# EAGLE design MicroMod_ATP_CarrierBoard (EAGLE 9.5.2)
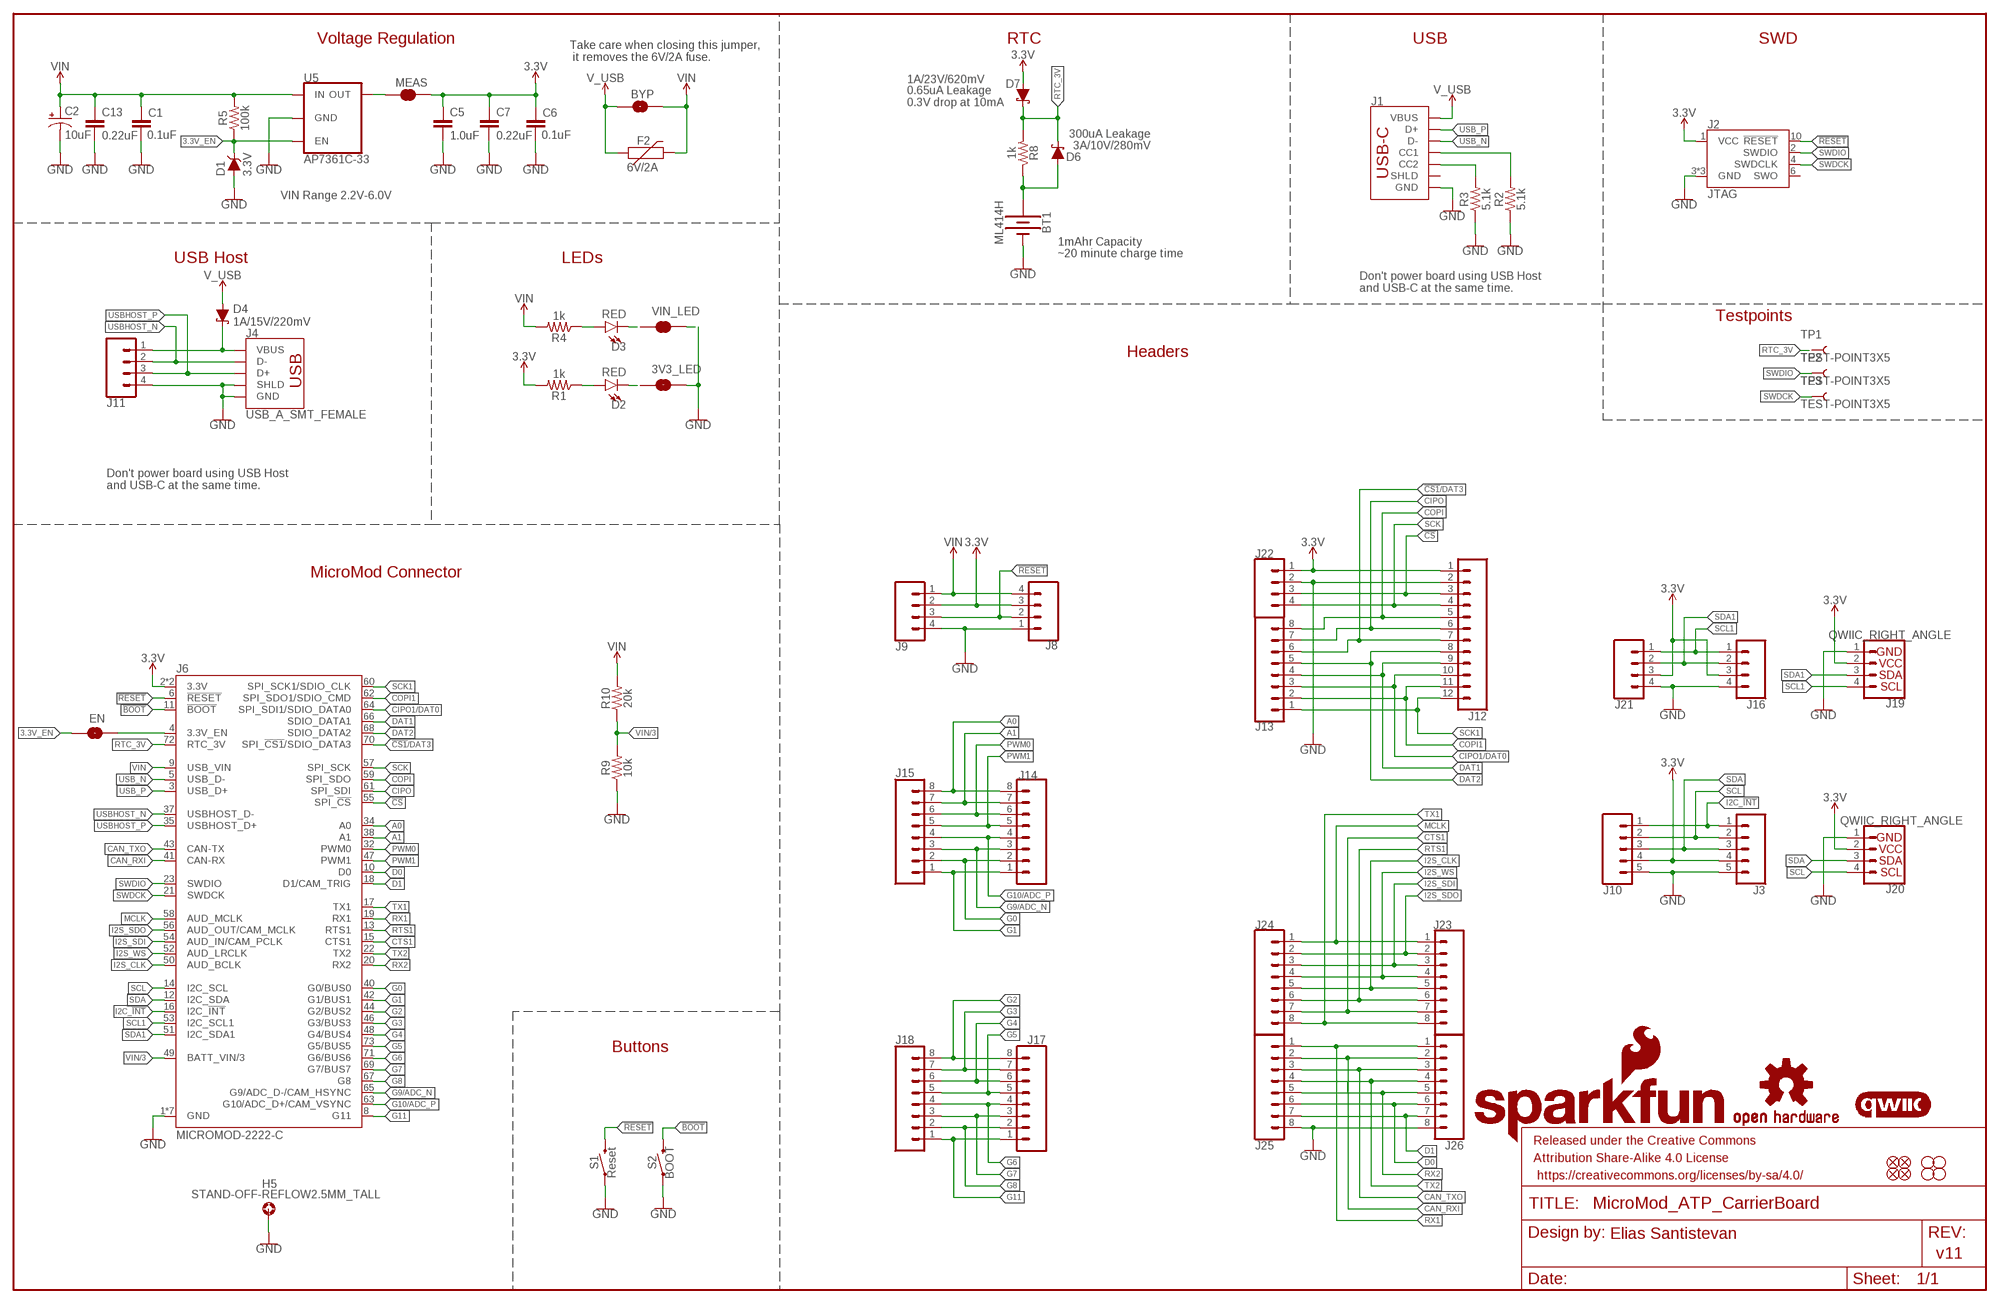
[diagram p0: schematic, sheet 1]

## Parts
3V3_LED  JUMPER-SMT_2_NC_TRACE_SILK  [SMT-JUMPER_2_NC_TRACE_SILK]
BT1  ML414H  ML414H_IV01E_BATTERY  [ML414H_IV01E]
BYP  JUMPER-SMT_2_NO_SILK  [SMT-JUMPER_2_NO_SILK]
C1  0.1uF  0.1UF-0603-25V-(+80/-20%)  [0603]
C2  10uF  10UF-POLAR-EIA3216-16V-10%(TANT)  [EIA3216]
C5  1.0uF  1.0UF-0603-16V-10%  [0603]
C6  0.1uF  0.1UF-0603-25V-(+80/-20%)  [0603]
C7  0.22uF  0.22UF-0603-25V-10%  [0603]
C13  0.22uF  0.22UF-0603-25V-10%  [0603]
D1  3.3V  DIODE-ZENER-MM3Z3V3T1G  [SOD-323]
D2  RED  LED-RED0603  [LED-0603]
D3  RED  LED-RED0603  [LED-0603]
D4  1A/15V/220mV  DIODE-SCHOTTKY-LSM115JE3  [DO-214BA]
D6  3A/10V/280mV  DIODE-SCHOTTKY-BAT60A  [SOD-323]
D7  1A/23V/620mV  DIODE-SCHOTTKY-BAT20J  [SOD-323]
EN  JUMPER-SMT_2_NO_SILK  [SMT-JUMPER_2_NO_SILK]
F2  6V/2A  PPTC_6V2A  [1210]
FD1  FIDUCIALUFIDUCIAL  [FIDUCIAL-MICRO]
FD2  FIDUCIALUFIDUCIAL  [FIDUCIAL-MICRO]
FD3  FIDUCIALUFIDUCIAL  [FIDUCIAL-MICRO]
FD4  FIDUCIALUFIDUCIAL  [FIDUCIAL-MICRO]
FRAME1  FRAME-LEDGER  [CREATIVE_COMMONS]
H1  STAND-OFF  [STAND-OFF]
H2  STAND-OFF  [STAND-OFF]
H3  STAND-OFF  [STAND-OFF]
H4  STAND-OFF  [STAND-OFF]
H5  STAND-OFF-REFLOW2.5MM_TALL  [STAND-OFF-REFLOW-M2.5]
J1  USB_C_2-LAYER_PADS  [USB-C-16P-2LAYER-PADS]
J2  JTAG  CORTEX_JTAG_DEBUG_MINIMUM_PTH  [2X5-PTH-1.27MM]
J3  CONN_05NO_SILK  [1X05_NO_SILK]
J4  USB_A_SMT_FEMALE  [USB-A-S-SILK-FEMALE]
J6  MICROMOD-2222-C  [M.2-CONNECTOR-E]
J8  1X04_SMD_STRAIGHT_COMBO  CONN_04SMD_STRAIGHT_COMBO  [1X04_SMD_VERTICAL_COMBO]
J9  CONN_041X04_NO_SILK  [1X04_NO_SILK]
J10  CONN_05VERT_FEMALE_HEADER  [1X05_SMD_VERTICAL_COMBO]
J11  CONN_041X04_NO_SILK_NO_POP  [1X04_NO_SILK]
J12  CONN_12SMD_COMBINED  [1X12_SMD_COMBINED]
J13  CONN_08NO_SILK_DNP  [1X08_NO_SILK]
J14  CONN_08SMD-COMBO-FEMALE  [1X08_SMD_COMBINED]
J15  CONN_08NO_SILK_FEMALE_PTH  [1X08_NO_SILK]
J16  CONN_041X04_NO_SILK_NO_POP  [1X04_NO_SILK]
J17  CONN_08SMD-COMBO-FEMALE  [1X08_SMD_COMBINED]
J18  CONN_08NO_SILK_FEMALE_PTH  [1X08_NO_SILK]
J19  QWIIC_RIGHT_ANGLE  QWIIC_CONNECTORJS-1MM  [JST04_1MM_RA]
J20  QWIIC_RIGHT_ANGLE  QWIIC_CONNECTORJS-1MM  [JST04_1MM_RA]
J21  1X04_SMD_STRAIGHT_COMBO  CONN_04SMD_STRAIGHT_COMBO  [1X04_SMD_VERTICAL_COMBO]
J22  CONN_041X04_NO_SILK_NO_POP  [1X04_NO_SILK]
J23  CONN_08NO_SILK_FEMALE_PTH  [1X08_NO_SILK]
J24  CONN_08SMD-COMBO-FEMALE  [1X08_SMD_COMBINED]
J25  CONN_08SMD-COMBO-FEMALE  [1X08_SMD_COMBINED]
J26  CONN_08NO_SILK_FEMALE_PTH  [1X08_NO_SILK]
LOGO1  SFE_LOGO_NAME_FLAME.1_INCH  [SFE_LOGO_NAME_FLAME_.1]
LOGO2  QWIIC_LOGO_5MM  [QWIIC_5MM]
LOGO3  OSHW-LOGOMINI  [OSHW-LOGO-MINI]
MEAS  JUMPER-COMBO_2_NC_TRACE  [COMBO-JUMPER_2_NC_TRACE]
R1  1k  1KOHM-0603-1/10W-1%  [0603]
R2  5.1k  5.1KOHM5.1KOHM-0603-1/10W-1%  [0603]
R3  5.1k  5.1KOHM5.1KOHM-0603-1/10W-1%  [0603]
R4  1k  1KOHM-0603-1/10W-1%  [0603]
R5  100k  100KOHM-0603-1/10W-1%  [0603]
R8  1k  1KOHM-0603-1/10W-1%  [0603]
R9  10k  10KOHM-0603-1/10W-1%  [0603]
R10  20k  20KOHM-0603-1/10W-1%  [0603]
S1  Reset  MOMENTARY-SWITCH-SPST-SMD-5.2-TALL-REDUNDANT  [TACTILE_SWITCH_SMD_5.2MM]
S2  BOOT  MOMENTARY-SWITCH-SPST-SMD-5.2-TALL-REDUNDANT  [TACTILE_SWITCH_SMD_5.2MM]
TP1  TEST-POINT3X5  [PAD.03X.05]
TP2  TEST-POINT3X5  [PAD.03X.05]
TP3  TEST-POINT3X5  [PAD.03X.05]
U5  AP7361C-33  AP7361C-33FGEUDFN-8  [UDFN-8]
VIN_LED  JUMPER-SMT_2_NC_TRACE_SILK  [SMT-JUMPER_2_NC_TRACE_SILK]

## Nets
3.3V: C5.1 C6.1 C7.1 D7.A J2.1(VCC) J3.4 J6.2(3.3V) J6.74(3.3V) J8.3 J9.2 J10.4 J12.1 J16.3 J19.2 J20.2 J21.3 J22.1 MEAS.2 MEAS.4 R1.2
3.3V_EN: D1.C EN.1 R5.1 U5.5(EN)
!BOOT!: J6.11(!BOOT!) S2.3 S2.4
!CS1!/DAT3: J6.70(SPI_!CS1!/SDIO_DATA3) J12.7 J13.6
!CS!: J6.55(SPI_!CS!) J12.3 J22.3
!RESET: J2.10(!RESET) J6.6(!RESET!) J8.2 J9.3 S1.3 S1.4
A0: J6.34(A0) J14.8 J15.8
A1: J6.38(A1) J14.7 J15.7
CAN_RXI: J6.41(CAN-RX) J25.2 J26.2
CAN_TXO: J6.43(CAN-TX) J25.3 J26.3
CIPO: J6.61(SPI_SDI) J12.6 J13.7
CIPO1/DAT0: J6.64(SPI_SDI1/SDIO_DATA0) J12.10 J13.3
COPI: J6.59(SPI_SDO) J12.5 J13.8
COPI1: J6.62(SPI_SDO1/SDIO_CMD) J12.11 J13.2
CTS1: J6.15(CTS1) J23.7 J24.7
D0: J6.10(D0) J25.6 J26.6
D1: J6.18(D1/CAM_TRIG) J25.7 J26.7
DAT1: J6.66(SDIO_DATA1) J12.9 J13.4
DAT2: J6.68(SDIO_DATA2) J12.8 J13.5
G0: J6.40(G0/BUS0) J14.2 J15.2
G1: J6.42(G1/BUS1) J14.1 J15.1
G2: J6.44(G2/BUS2) J17.8 J18.8
G3: J6.46(G3/BUS3) J17.7 J18.7
G4: J6.48(G4/BUS4) J17.6 J18.6
G5: J6.73(G5/BUS5) J17.5 J18.5
G6: J6.71(G6/BUS6) J17.4 J18.4
G7: J6.69(G7/BUS7) J17.3 J18.3
G8: J6.67(G8) J17.2 J18.2
G9/ADC_N [Diff pairs]: J6.65(G9/ADC_D-/CAM_HSYNC) J14.3 J15.3
G10/ADC_P [Diff pairs]: J6.63(G10/ADC_D+/CAM_VSYNC) J14.4 J15.4
G11: J6.8(G11) J17.1 J18.1
GND: 3V3_LED.2 BT1.- C1.2 C2.- C5.2 C6.2 C7.2 C13.2 D1.A H5.1 J1.GND J1.GND2(GND) J2.3(GND) J2.5(GND) J2.9(GND) J3.5 J4.GND J4.SHLD1(SHLD) J4.SHLD2(SHLD) J6.1(GND) J6.7(GND) J6.33(GND) J6.36(GND) J6.39(GND) J6.45(GND) J6.75(GND) J8.1 J9.4 J10.5 J11.4 J12.2 J16.4 J19.1 J20.1 J21.4 J22.2 J25.8 J26.8 R2.1 R3.1 R9.1 S1.1 S1.2 S2.1 S2.2 U5.4(GND) U5.EP(GND) VIN_LED.2
I2C_!INT: J3.1 J6.16(I2C_!INT!) J10.1
I2S_CLK: J6.50(AUD_BCLK) J23.5 J24.5
I2S_SDI: J6.54(AUD_IN/CAM_PCLK) J23.3 J24.3
I2S_SDO: J6.56(AUD_OUT/CAM_MCLK) J23.2 J24.2
I2S_WS: J6.52(AUD_LRCLK) J23.4 J24.4
MCLK: J6.58(AUD_MCLK) J23.1 J24.1
N$1: D2.A R1.1
N$2: D3.A R4.1
N$3: 3V3_LED.1 D2.C
N$4: D3.C VIN_LED.1
N$5: EN.2 J6.4(3.3V_EN)
N$7: D4.C J4.VBUS J11.1
N$10: J1.A5(CC1) R2.2
N$11: J1.B5(CC2) R3.2
N$14: BT1.+ D6.A R8.1
OUT_MEAS: MEAS.1 MEAS.3 U5.1(OUT)
PWM0: J6.32(PWM0) J14.6 J15.6
PWM1: J6.47(PWM1) J14.5 J15.5
RTC_3V: D6.C D7.C J6.72(RTC_3V) R8.2 TP1.P$1
RTS1: J6.13(RTS1) J23.6 J24.6
RX1: J6.19(RX1) J25.1 J26.1
RX2: J6.20(RX2) J25.5 J26.5
SCK: J6.57(SPI_SCK) J12.4 J22.4
SCK1: J6.60(SPI_SCK1/SDIO_CLK) J12.12 J13.1
SCL: J3.2 J6.14(I2C_SCL) J10.2 J20.4
SCL1: J6.53(I2C_SCL1) J16.1 J19.4 J21.1
SDA: J3.3 J6.12(I2C_SDA) J10.3 J20.3
SDA1: J6.51(I2C_SDA1) J16.2 J19.3 J21.2
SWDCK: J2.4(SWDCLK) J6.21(SWDCK) TP3.P$1
SWDIO: J2.2(SWDIO) J6.23(SWDIO) TP2.P$1
TX1: J6.17(TX1) J23.8 J24.8
TX2: J6.22(TX2) J25.4 J26.4
USB_N [Diff pairs]: J1.A7(D-) J1.B7(D-) J6.5(USB_D-)
USB_P [Diff pairs]: J1.A6(D+) J1.B6(D+) J6.3(USB_D+)
USBHOST_N [Diff pairs]: J4.D- J6.37(USBHOST_D-) J11.2
USBHOST_P [Diff pairs]: J4.D+ J6.35(USBHOST_D+) J11.3
V_USB: BYP.1 D4.A F2.1 J1.VBUS1(VBUS) J1.VBUS2(VBUS)
VIN: BYP.2 C1.1 C2.+ C13.1 F2.2 J6.9(USB_VIN) J8.4 J9.1 R4.2 R5.2 R10.2 U5.8(IN)
VIN/3: J6.49(BATT_VIN/3) R9.2 R10.1
Unconnected: J1.SHLD1(SHLD) J1.SHLD2(SHLD) J1.SHLD3(SHLD) J1.SHLD4(SHLD) J2.6(SWO)

## Notes on the sheet
- Voltage Regulation | RTC | USB | SWD
- Take care when closing this jumper,
   it removes the 6V/2A fuse.
- 0.65uA Leakage
  0.3V drop at 10mA
- 300uA Leakage
- VIN Range 2.2V-6.0V
- 1mAhr Capacity
- USB Host | LEDs | ~20 minute charge time
- Don't power board using USB Host 
  and USB-C at the same time.
- Testpoints
- Headers
- Don't power board using USB Host 
  and USB-C at the same time.
- MicroMod Connector
- Buttons
- Elias Santistevan
- v11

## Library data of the parts
3V3_LED VIN_LED = SparkFun-Jumpers:JUMPER-SMT_2_NC_TRACE: Normally closed trace jumper This jumper has a trace between two pads so it's normally closed (NC). Use a razor knife to open the connection. For best results follow the IPC guidelines for cutting traces: Cutout at least 0.063 mm (0.005 in). Remove all loose material to clean up the cut area. Seal the cut with an approved epoxy. Reapply solder to reclose the connection.
BT1 = SparkFun-Batteries:ML414H_IV01E_BATTERY: SEIKO ML414H-IV01E Reflowable Lithium Battery ML414H is a rechargeable, coin type battery with features such as Pb-free reflowable (Peak temperature: 260 C) and high temperature heat resistance. Battery Characteristics: 3.1V max voltage Voff is 2V 1mAH 3k series resistor with battery 72 hour charge time from 2.0-3.1V 2.3-2.8V initial charge; PROD_ID: BATT-14267
BYP EN = SparkFun-Jumpers:JUMPER-SMT_2_NO: Normally open jumper This jumper has two pads in close proximity to each other. Apply solder to close the connection. Round pads are easier to solder for beginners, but are a lot larger. SparkFun Product that uses the round pads: SparkFun EL Sequencer <https://www.sparkfun.com/products/12781>
C1 C6 = SparkFun-Capacitors:0.1UF: 0.1µF ceramic capacitors A capacitor is a passive two-terminal electrical component used to store electrical energy temporarily in an electric field.; PROD_ID: CAP-00810
C2 = SparkFun-Capacitors:10UF-POLAR: 10.0µF polarized capacitors A capacitor is a passive two-terminal electrical component used to store electrical energy temporarily in an electric field.; PROD_ID: CAP-00811
C5 = SparkFun-Capacitors:1.0UF: 1µF ceramic capacitors A capacitor is a passive two-terminal electrical component used to store electrical energy temporarily in an electric field.; PROD_ID: CAP-00868
C7 C13 = SparkFun-Capacitors:0.22UF: 0.22µF ceramic capacitors A capacitor is a passive two-terminal electrical component used to store electrical energy temporarily in an electric field.; PROD_ID: CAP-07822
D1 = SparkFun-DiscreteSemi:DIODE-ZENER: Zener Diode A Zener diode allows current to flow from its anode to its cathode like a normal semiconductor diode, but it also permits current to flow in the reverse direction when its "Zener voltage" is reached. - WIkipedia; PROD_ID: DIO-11284
D2 D3 = SparkFun-LED:LED-RED: Red SMD LED Used in manufacturing of most products at SparkFun Packages: 0603 - SMD 0603 package [Product Link] <http://docs.avagotech.com/docs/AV02-0551EN> 0603 SMART - SMD 0603 SMART package ( more efficient and expensive)[Product Link] <http://www.osram-os.com/Graphics/XPic2/00077099_0.pdf> 1206 - SMD1206 package [Product Link] <https://www.sparkfun.com/datasheets/DevTools/LilyPad/Q150OVS4.pdff> SparkFun Products: Pro Mini 328 -5V <https://www.sparkfun.com/products/821> RedBoard <https://www.sparkfun.com/products/12757> IOIO-OTG <https://www.sparkfun.com/products/13613>; PROD_ID: DIO-00819
D4 = SparkFun-DiscreteSemi:DIODE-SCHOTTKY: Schottky diode A Schottky diode is a semiconductor diode which has a low forward voltage drop and a very fast switching action.; PROD_ID: DIO-15271
D6 = SparkFun-DiscreteSemi:DIODE-SCHOTTKY: Schottky diode A Schottky diode is a semiconductor diode which has a low forward voltage drop and a very fast switching action.; PROD_ID: DIO-14072
D7 = SparkFun-DiscreteSemi:DIODE-SCHOTTKY: Schottky diode A Schottky diode is a semiconductor diode which has a low forward voltage drop and a very fast switching action.; PROD_ID: DIO-11623
F2 = SparkFun-Fuses:PPTC: Resettable Fuse PPTC Resettable Fuse. Really a sort of resistor with a polymeric positive temperature coefficient whose resistance increases dramatically with an increase in temperature. When heated by the power passing through the resistance rises causing the current to be limited, protecting the circuit. This is achieved by the transition of the polymer from a crystalline to an amorphous state where the conductive carbon separates breaking the conductive pathways found in the cool crystalline structure. When a PPTC cools back down it resumes conducting letting the circuit turn back on. SparkFun Products: SparkFun RedBoard - Programmed with Arduino <https://www.sparkfun.com/products/12757> Pro Micro - 5V/16MHz <https://www.sparkfun.com/products/12640> Arduino Pro 328 - 5V/16MHz <https://www.sparkfun.com/products/10915> MP3 Trigger <https://www.sparkfun.com/products/13720>; PROD_ID: RES-14313
FD1-FD4 = SparkFun-Aesthetics:FIDUCIAL: Fiducial Alignment Points Point-of-reference for pick-and-place machines and other optical instruments.
FRAME1 = SparkFun-Aesthetics:FRAME-LEDGER: Schematic Frame - Ledger Standard 11x14 US Ledger frame
H1-H4 = SparkFun-Hardware:STAND-OFF: Stand Off Drill holes for mechanically mounting via screws, standoffs, etc. Note: Use the keepout ring to avoid running the screw head into surrounding components. Variant Overviews STAND-OFF - Mechanical footprint for a #4 phillips button head screw. STAND-OFF-TIGHT - Mechanical footprint for a #4 phillips button head screw, Example SparkFun Products Screw - Phillips Head (1/4", 4-40, 10 pack) <https://www.sparkfun.com/products/10453> (PRT-10453) Screw - Phillips Head (1/2", 4-40, 10 pack) <https://www.sparkfun.com/products/10452> (PRT-10452) Screw - Phillips Head (3/4", 4-40, 10 pack) <https://www.sparkfun.com/products/10451> (PRT-10451) Screw - Phillips Head (1", 4-40, 10 pack) <https://www.sparkfun.com/products/10450> (PRT-10450)
H5 = SparkFun-Hardware:STAND-OFF-REFLOW: Stand Off Reflow Compatible A metal standoff that can be placed and reflowed onto a PCB.; PROD_ID: HW-14899
J1 = SparkFun-Connectors:USB_C: USB Type C 16Pin Connector Super Speed pins not available on the 16-pin purely SMD connector so this part is best for USB 2.0 implementations. D1 and D2 are tied together enabling D+/- no matter which way the cable is plugged into the connector. The two channel configuration pins (CC1/2) are exposed. These are normally connected to ground via 5.1k resistors but can be reconfigured for high current/high power applications.; PROD_ID: CONN-14122
J2 = SparkFun-Connectors:CORTEX_JTAG_DEBUG_MINIMUM: Cortex Debug Connector - 10 pin Supports JTAG debug, Serial Wire debug, and Serial Wire Viewer. PTH and SMD connector options available. General Connector Information <http://infocenter.arm.com/help/topic/com.arm.doc.faqs/attached/13634/cortex_debug_connectors.pdf> Products: PTH Connector <http://www.digikey.com/product-detail/en/cnc-tech/3220-10-0100-00/1175-1627-ND/3883661> -via Digi-Key SparkFun PSoc <https://www.sparkfun.com/products/13229> SparkFun T <https://www.sparkfun.com/products/13810>
J3 = SparkFun-Connectors:CONN_05: Multi connection point. Often used as Generic Header-pin footprint for 0.1 inch spaced/style header connections On any of the 0.1 inch spaced packages, you can populate with these: Break Away Headers - Straight <https://www.sparkfun.com/products/116> (PRT-00116) Break Away Male Headers - Right Angle <https://www.sparkfun.com/products/553> (PRT-00553) Female Headers <https://www.sparkfun.com/products/115> (PRT-00115) Break Away Headers - Machine Pin <https://www.sparkfun.com/products/117> (PRT-00117) Break Away Female Headers - Swiss Machine Pin <https://www.sparkfun.com/products/743> (PRT-00743) For SCREWTERMINALS and SPRING TERMINALS visit here: Screw Terimnals on SparkFun.com <https://www.sparkfun.com/search/results?term=Screw+Terminals> (5mm/3.5mm/2.54mm spacing) This device is also useful as a general connection point to wire up your design to another part of your project. Our various solder wires solder well into these plated through hole pads. Hook-Up Wire - Assortment (Stranded, 22 AWG) <https://www.sparkfun.com/products/11375> (PRT-11375) Hook-Up Wire - Assortment (Solid Core, 22 AWG) <https://www.sparkfun.com/products/11367> (PRT-11367) View the entire wire category on our website here <https://www.sparkfun.com/categories/141> Special notes: Molex polarized connector foot print use with SKU : PRT-08231 with associated crimp pins and housings. 1MM SMD Version SKU: PRT-10208
J4 = SparkFun-Connectors:USB_A: USB-A Connector Male and female variants, as well as PTH and SMT variants SparkFun Products: SparkFun XBee Explorer Dongle <https://www.sparkfun.com/products/11697> PTH Male SparkFun MicroView-USB Programmer <https://www.sparkfun.com/products/12924> SMT Male SparkFun USB Type A Female Breakout <https://www.sparkfun.com/products/12700> SMT Female; PROD_ID: CONN-09520; SF_ID: PRT-09011
J6 = SparkFun-MicroMod:MICROMOD: MicroMod Connector Description: A card edge connector and mating PCB connector to allow various MicroMod Processor Boards to be coupled with various carrier boards of different capabilities. Based on the M.2 standard.; PROD_ID: CONN-14877
J8 J21 = SparkFun-Connectors:CONN_04: Multi connection point. Often used as Generic Header-pin footprint for 0.1 inch spaced/style header connections On any of the 0.1 inch spaced packages, you can populate with these: Break Away Headers - Straight <https://www.sparkfun.com/products/116> (PRT-00116) Break Away Male Headers - Right Angle <https://www.sparkfun.com/products/553> (PRT-00553) Female Headers <https://www.sparkfun.com/products/115> (PRT-00115) Break Away Headers - Machine Pin <https://www.sparkfun.com/products/117> (PRT-00117) Break Away Female Headers - Swiss Machine Pin <https://www.sparkfun.com/products/743> (PRT-00743) For SCREWTERMINALS and SPRING TERMINALS visit here: Screw Terimnals on SparkFun.com <https://www.sparkfun.com/search/results?term=Screw+Terminals> (5mm/3.5mm/2.54mm spacing) This device is also useful as a general connection point to wire up your design to another part of your project. Our various solder wires solder well into these plated through hole pads. Hook-Up Wire - Assortment (Stranded, 22 AWG) <https://www.sparkfun.com/products/11375> (PRT-11375) Hook-Up Wire - Assortment (Solid Core, 22 AWG) <https://www.sparkfun.com/products/11367> (PRT-11367) View the entire wire category on our website here <https://www.sparkfun.com/categories/141> Special notes: Molex polarized connector foot print use with SKU : PRT-08231 with associated crimp pins and housings. 1MM SMD Version SKU: PRT-10208; PROD_ID: CONN-08511
J9 = SparkFun-Connectors:CONN_04: Multi connection point. Often used as Generic Header-pin footprint for 0.1 inch spaced/style header connections On any of the 0.1 inch spaced packages, you can populate with these: Break Away Headers - Straight <https://www.sparkfun.com/products/116> (PRT-00116) Break Away Male Headers - Right Angle <https://www.sparkfun.com/products/553> (PRT-00553) Female Headers <https://www.sparkfun.com/products/115> (PRT-00115) Break Away Headers - Machine Pin <https://www.sparkfun.com/products/117> (PRT-00117) Break Away Female Headers - Swiss Machine Pin <https://www.sparkfun.com/products/743> (PRT-00743) For SCREWTERMINALS and SPRING TERMINALS visit here: Screw Terimnals on SparkFun.com <https://www.sparkfun.com/search/results?term=Screw+Terminals> (5mm/3.5mm/2.54mm spacing) This device is also useful as a general connection point to wire up your design to another part of your project. Our various solder wires solder well into these plated through hole pads. Hook-Up Wire - Assortment (Stranded, 22 AWG) <https://www.sparkfun.com/products/11375> (PRT-11375) Hook-Up Wire - Assortment (Solid Core, 22 AWG) <https://www.sparkfun.com/products/11367> (PRT-11367) View the entire wire category on our website here <https://www.sparkfun.com/categories/141> Special notes: Molex polarized connector foot print use with SKU : PRT-08231 with associated crimp pins and housings. 1MM SMD Version SKU: PRT-10208; PROD_ID: CONN-09696
J10 = SparkFun-Connectors:CONN_05: Multi connection point. Often used as Generic Header-pin footprint for 0.1 inch spaced/style header connections On any of the 0.1 inch spaced packages, you can populate with these: Break Away Headers - Straight <https://www.sparkfun.com/products/116> (PRT-00116) Break Away Male Headers - Right Angle <https://www.sparkfun.com/products/553> (PRT-00553) Female Headers <https://www.sparkfun.com/products/115> (PRT-00115) Break Away Headers - Machine Pin <https://www.sparkfun.com/products/117> (PRT-00117) Break Away Female Headers - Swiss Machine Pin <https://www.sparkfun.com/products/743> (PRT-00743) For SCREWTERMINALS and SPRING TERMINALS visit here: Screw Terimnals on SparkFun.com <https://www.sparkfun.com/search/results?term=Screw+Terminals> (5mm/3.5mm/2.54mm spacing) This device is also useful as a general connection point to wire up your design to another part of your project. Our various solder wires solder well into these plated through hole pads. Hook-Up Wire - Assortment (Stranded, 22 AWG) <https://www.sparkfun.com/products/11375> (PRT-11375) Hook-Up Wire - Assortment (Solid Core, 22 AWG) <https://www.sparkfun.com/products/11367> (PRT-11367) View the entire wire category on our website here <https://www.sparkfun.com/categories/141> Special notes: Molex polarized connector foot print use with SKU : PRT-08231 with associated crimp pins and housings. 1MM SMD Version SKU: PRT-10208; PROD_ID: CONN-15262
J11 J16 J22 = SparkFun-Connectors:CONN_04: Multi connection point. Often used as Generic Header-pin footprint for 0.1 inch spaced/style header connections On any of the 0.1 inch spaced packages, you can populate with these: Break Away Headers - Straight <https://www.sparkfun.com/products/116> (PRT-00116) Break Away Male Headers - Right Angle <https://www.sparkfun.com/products/553> (PRT-00553) Female Headers <https://www.sparkfun.com/products/115> (PRT-00115) Break Away Headers - Machine Pin <https://www.sparkfun.com/products/117> (PRT-00117) Break Away Female Headers - Swiss Machine Pin <https://www.sparkfun.com/products/743> (PRT-00743) For SCREWTERMINALS and SPRING TERMINALS visit here: Screw Terimnals on SparkFun.com <https://www.sparkfun.com/search/results?term=Screw+Terminals> (5mm/3.5mm/2.54mm spacing) This device is also useful as a general connection point to wire up your design to another part of your project. Our various solder wires solder well into these plated through hole pads. Hook-Up Wire - Assortment (Stranded, 22 AWG) <https://www.sparkfun.com/products/11375> (PRT-11375) Hook-Up Wire - Assortment (Solid Core, 22 AWG) <https://www.sparkfun.com/products/11367> (PRT-11367) View the entire wire category on our website here <https://www.sparkfun.com/categories/141> Special notes: Molex polarized connector foot print use with SKU : PRT-08231 with associated crimp pins and housings. 1MM SMD Version SKU: PRT-10208
J12 = SparkFun-Connectors:CONN_12: Multi connection point. Often used as Generic Header-pin footprint for 0.1 inch spaced/style header connections On any of the 0.1 inch spaced packages, you can populate with these: Break Away Headers - Straight <https://www.sparkfun.com/products/116> (PRT-00116) Break Away Male Headers - Right Angle <https://www.sparkfun.com/products/553> (PRT-00553) Female Headers <https://www.sparkfun.com/products/115> (PRT-00115) Break Away Headers - Machine Pin <https://www.sparkfun.com/products/117> (PRT-00117) Break Away Female Headers - Swiss Machine Pin <https://www.sparkfun.com/products/743> (PRT-00743) For SCREWTERMINALS and SPRING TERMINALS visit here: Screw Terimnals on SparkFun.com <https://www.sparkfun.com/search/results?term=Screw+Terminals> (5mm/3.5mm/2.54mm spacing) This device is also useful as a general connection point to wire up your design to another part of your project. Our various solder wires solder well into these plated through hole pads. Hook-Up Wire - Assortment (Stranded, 22 AWG) <https://www.sparkfun.com/products/11375> (PRT-11375) Hook-Up Wire - Assortment (Solid Core, 22 AWG) <https://www.sparkfun.com/products/11367> (PRT-11367) View the entire wire category on our website here <https://www.sparkfun.com/categories/141> Special notes: Molex polarized connector foot print use with SKU : PRT-08231 with associated crimp pins and housings. 1MM SMD Version SKU: PRT-10208 NOTES ON THE VARIANTS LOCK and LOCK_LONGPADS... This footprint was designed to help hold the alignment of a through-hole component (i.e. 6-pin header) while soldering it into place. You may notice that each hole has been shifted either up or down by 0.005 of an inch from it's more standard position (which is a perfectly straight line). This slight alteration caused the pins (the squares in the middle) to touch the edges of the holes. Because they are alternating, it causes a "brace" to hold the component in place. 0.005 has proven to be the perfect amount of "off-center" position when using our standard breakaway headers. Although looks a little odd when you look at the bare footprint, once you have a header in there, the alteration is very hard to notice. Also,if you push a header all the way into place, it is covered up entirely on the bottom side.; PROD_ID: CONN-15197
J13 = SparkFun-Connectors:CONN_08: Multi connection point. Often used as Generic Header-pin footprint for 0.1 inch spaced/style header connections On any of the 0.1 inch spaced packages, you can populate with these: Break Away Headers - Straight <https://www.sparkfun.com/products/116> (PRT-00116) Break Away Male Headers - Right Angle <https://www.sparkfun.com/products/553> (PRT-00553) Female Headers <https://www.sparkfun.com/products/115> (PRT-00115) Break Away Headers - Machine Pin <https://www.sparkfun.com/products/117> (PRT-00117) Break Away Female Headers - Swiss Machine Pin <https://www.sparkfun.com/products/743> (PRT-00743) Arduino Stackable Header - 8 Pin <https://www.sparkfun.com/products/9279> (PRT-09279) For SCREWTERMINALS and SPRING TERMINALS visit here: Screw Terimnals on SparkFun.com <https://www.sparkfun.com/search/results?term=Screw+Terminals> (5mm/3.5mm/2.54mm spacing) This device is also useful as a general connection point to wire up your design to another part of your project. Our various solder wires solder well into these plated through hole pads. Hook-Up Wire - Assortment (Stranded, 22 AWG) <https://www.sparkfun.com/products/11375> (PRT-11375) Hook-Up Wire - Assortment (Solid Core, 22 AWG) <https://www.sparkfun.com/products/11367> (PRT-11367) View the entire wire category on our website here <https://www.sparkfun.com/categories/141> Special notes: Molex polarized connector foot print use with SKU : PRT-08231 with associated crimp pins and housings. 1MM SMD Version SKU: PRT-10208 NOTES ON THE VARIANTS LOCK and LOCK_LONGPADS... This footprint was designed to help hold the alignment of a through-hole component (i.e. 6-pin header) while soldering it into place. You may notice that each hole has been shifted either up or down by 0.005 of an inch from it's more standard position (which is a perfectly straight line). This slight alteration caused the pins (the squares in the middle) to touch the edges of the holes. Because they are alternating, it causes a "brace" to hold the component in place. 0.005 has proven to be the perfect amount of "off-center" position when using our standard breakaway headers. Although looks a little odd when you look at the bare footprint, once you have a header in there, the alteration is very hard to notice. Also,if you push a header all the way into place, it is covered up entirely on the bottom side.
J14 J17 J24 J25 = SparkFun-Connectors:CONN_08: Multi connection point. Often used as Generic Header-pin footprint for 0.1 inch spaced/style header connections On any of the 0.1 inch spaced packages, you can populate with these: Break Away Headers - Straight <https://www.sparkfun.com/products/116> (PRT-00116) Break Away Male Headers - Right Angle <https://www.sparkfun.com/products/553> (PRT-00553) Female Headers <https://www.sparkfun.com/products/115> (PRT-00115) Break Away Headers - Machine Pin <https://www.sparkfun.com/products/117> (PRT-00117) Break Away Female Headers - Swiss Machine Pin <https://www.sparkfun.com/products/743> (PRT-00743) Arduino Stackable Header - 8 Pin <https://www.sparkfun.com/products/9279> (PRT-09279) For SCREWTERMINALS and SPRING TERMINALS visit here: Screw Terimnals on SparkFun.com <https://www.sparkfun.com/search/results?term=Screw+Terminals> (5mm/3.5mm/2.54mm spacing) This device is also useful as a general connection point to wire up your design to another part of your project. Our various solder wires solder well into these plated through hole pads. Hook-Up Wire - Assortment (Stranded, 22 AWG) <https://www.sparkfun.com/products/11375> (PRT-11375) Hook-Up Wire - Assortment (Solid Core, 22 AWG) <https://www.sparkfun.com/products/11367> (PRT-11367) View the entire wire category on our website here <https://www.sparkfun.com/categories/141> Special notes: Molex polarized connector foot print use with SKU : PRT-08231 with associated crimp pins and housings. 1MM SMD Version SKU: PRT-10208 NOTES ON THE VARIANTS LOCK and LOCK_LONGPADS... This footprint was designed to help hold the alignment of a through-hole component (i.e. 6-pin header) while soldering it into place. You may notice that each hole has been shifted either up or down by 0.005 of an inch from it's more standard position (which is a perfectly straight line). This slight alteration caused the pins (the squares in the middle) to touch the edges of the holes. Because they are alternating, it causes a "brace" to hold the component in place. 0.005 has proven to be the perfect amount of "off-center" position when using our standard breakaway headers. Although looks a little odd when you look at the bare footprint, once you have a header in there, the alteration is very hard to notice. Also,if you push a header all the way into place, it is covered up entirely on the bottom side.; PROD_ID: CONN-10204; SF_ID: PRT-11543
J15 J18 J23 J26 = SparkFun-Connectors:CONN_08: Multi connection point. Often used as Generic Header-pin footprint for 0.1 inch spaced/style header connections On any of the 0.1 inch spaced packages, you can populate with these: Break Away Headers - Straight <https://www.sparkfun.com/products/116> (PRT-00116) Break Away Male Headers - Right Angle <https://www.sparkfun.com/products/553> (PRT-00553) Female Headers <https://www.sparkfun.com/products/115> (PRT-00115) Break Away Headers - Machine Pin <https://www.sparkfun.com/products/117> (PRT-00117) Break Away Female Headers - Swiss Machine Pin <https://www.sparkfun.com/products/743> (PRT-00743) Arduino Stackable Header - 8 Pin <https://www.sparkfun.com/products/9279> (PRT-09279) For SCREWTERMINALS and SPRING TERMINALS visit here: Screw Terimnals on SparkFun.com <https://www.sparkfun.com/search/results?term=Screw+Terminals> (5mm/3.5mm/2.54mm spacing) This device is also useful as a general connection point to wire up your design to another part of your project. Our various solder wires solder well into these plated through hole pads. Hook-Up Wire - Assortment (Stranded, 22 AWG) <https://www.sparkfun.com/products/11375> (PRT-11375) Hook-Up Wire - Assortment (Solid Core, 22 AWG) <https://www.sparkfun.com/products/11367> (PRT-11367) View the entire wire category on our website here <https://www.sparkfun.com/categories/141> Special notes: Molex polarized connector foot print use with SKU : PRT-08231 with associated crimp pins and housings. 1MM SMD Version SKU: PRT-10208 NOTES ON THE VARIANTS LOCK and LOCK_LONGPADS... This footprint was designed to help hold the alignment of a through-hole component (i.e. 6-pin header) while soldering it into place. You may notice that each hole has been shifted either up or down by 0.005 of an inch from it's more standard position (which is a perfectly straight line). This slight alteration caused the pins (the squares in the middle) to touch the edges of the holes. Because they are alternating, it causes a "brace" to hold the component in place. 0.005 has proven to be the perfect amount of "off-center" position when using our standard breakaway headers. Although looks a little odd when you look at the bare footprint, once you have a header in there, the alteration is very hard to notice. Also,if you push a header all the way into place, it is covered up entirely on the bottom side.; PROD_ID: CONN-08438
J19 J20 = SparkFun-Connectors:QWIIC_CONNECTOR: SparkFun I2C Standard Qwiic Connector An SMD 1mm pitch JST connector makes it easy and quick (get it? Qwiic?) to connect I2C devices to each other. The Qwiic system <http://www.sparkfun.com/qwiic> enables fast and solderless connection between popular platforms and various sensors and actuators. We carry 200mm <https://www.sparkfun.com/products/14204>, 100mm <https://www.sparkfun.com/products/14205>, 50mm <https://www.sparkfun.com/products/14206>, and breadboard friendly <https://www.sparkfun.com/products/14207> Qwiic cables. We also offer 10 pcs strips <https://www.sparkfun.com/products/14323> the SMD connectors.; PROD_ID: CONN-13694
LOGO1 = SparkFun-Aesthetics:SFE_LOGO_NAME_FLAME: SparkFun Font Logo w/ Flame This is the SparkFun full logo. The logo on the schematic will always be the same size; the package variant is the height of the flame part of the logo. Default layer for the logo on the board is tSilk.
LOGO2 = SparkFun-Aesthetics:QWIIC_LOGO: Qwiic Logos for placement on schematic and PCB. The 5.5mm silk logo is best for placing next to Qwiic connector.
LOGO3 = SparkFun-Aesthetics:OSHW-LOGO: Open-Source Hardware (OSHW) Logo This logo indicates the piece of hardware it is found on incorporates a OSHW license and/or adheres to the definition of open source hardware found here: http://freedomdefined.org/OSHW
MEAS = SparkFun-Jumpers:JUMPER-COMBO_2_NC_TRACE
R1 R4 R8 = SparkFun-Resistors:1KOHM: 1kΩ resistor A resistor is a passive two-terminal electrical component that implements electrical resistance as a circuit element. Resistors act to reduce current flow, and, at the same time, act to lower voltage levels within circuits. - Wikipedia; PROD_ID: RES-07856
R2 R3 = SparkFun-Resistors:5.1KOHM; PROD_ID: RES-12083
R5 = SparkFun-Resistors:100KOHM: 100kΩ resistor A resistor is a passive two-terminal electrical component that implements electrical resistance as a circuit element. Resistors act to reduce current flow, and, at the same time, act to lower voltage levels within circuits. - Wikipedia; PROD_ID: RES-07828
R9 = SparkFun-Resistors:10KOHM: 10kΩ resistor A resistor is a passive two-terminal electrical component that implements electrical resistance as a circuit element. Resistors act to reduce current flow, and, at the same time, act to lower voltage levels within circuits. - Wikipedia; PROD_ID: RES-00824
R10 = SparkFun-Resistors:20KOHM: 20kΩ resistor A resistor is a passive two-terminal electrical component that implements electrical resistance as a circuit element. Resistors act to reduce current flow, and, at the same time, act to lower voltage levels within circuits. - Wikipedia; PROD_ID: RES-09383
S1 S2 = SparkFun-Switches:MOMENTARY-SWITCH-SPST: Momentary Switch (Pushbutton) - SPST Normally-open (NO) SPST momentary switches (buttons, pushbuttons). Variants PTH-12MM - 12mm square, through-hole Momentary Pushbutton Switch - 12mm Square <https://www.sparkfun.com/products/9190> (COM-09190) PTH-6.0MM, PTH-6.0MM-KIT - 6.0mm square, through-hole Mini Pushbutton Switch <https://www.sparkfun.com/products/97> (COM-00097) KIT package intended for soldering kit's - only one side of pads' copper is exposed. PTH-RIGHT-ANGLE-KIT - Right-angle, through-hole Right Angle Tactile Button <https://www.sparkfun.com/products/10791> - Used on SparkFun BigTime Watch Kit <https://www.sparkfun.com/products/11734> SMD-12MM - 12mm square, surface-mount Tactile Button - SMD (12mm) <https://www.sparkfun.com/products/12993> (COM-12993) Used on SparkFun PicoBoard <https://www.sparkfun.com/products/11888> SMD-4.5MM - 4.5mm Square Trackball Switch Used on SparkFun Blackberry Trackballer Breakout <https://www.sparkfun.com/products/13169> SMD-4.6MMX2.8MM - 4.60mm x 2.80mm, surface mount Used on SparkFun SAMD21 Mini Breakout <https://www.sparkfun.com/products/13664> SMD-5.2MM, SMD-5.2-REDUNDANT - 5.2mm square, surface-mount Mini Pushbutton Switch - SMD <https://www.sparkfun.com/products/8720> (COM-08720) Used on Arduino Pro Mini <https://www.sparkfun.com/products/11114> REDUNDANT package connects both switch circuits together SMD-6.0X3.5MM - 6.0 x 3.5mm, surface mount Momentary Reset Switch SMD <https://www.sparkfun.com/products/8229> (COM-08229) SMD-6.2MM-TALL - 6.2mm square, surface mount Tactile Button - SMD (6mm) <https://www.sparkfun.com/products/12992> Used on SparkFun Digital Sandbox <https://www.sparkfun.com/products/12651> SMD-RIGHT-ANGLE - Right-angle, surface mount Used on SparkFun Block for Intel® Edison - Arduino <https://www.sparkfun.com/products/13036>; PROD_ID: SWCH-14139
TP1-TP3 = SparkFun-Connectors:TEST-POINT: SparkFun Test Points Bare copper test points for troubleshooting or In-Circuit-Testing. These are used by our Production team for verifying production board runs using pogo-pins on test beds. SparkFun Products: SparkFun LSM9DS1 Breakout <https://www.sparkfun.com/products/13284> SparkFun PSOC <https://www.sparkfun.com/products/13714> SparkFun Load Cell Amplifier <https://www.sparkfun.com/products/13879>
U5 = SparkFun-IC-Power:AP7361C-33FGE: AP7361C 3.3V LDO Regulator; PROD_ID: VREG-14094

## Net classes
0 default: width 0 mm, drill 0 mm
1 power: width 0.762 mm

## Board
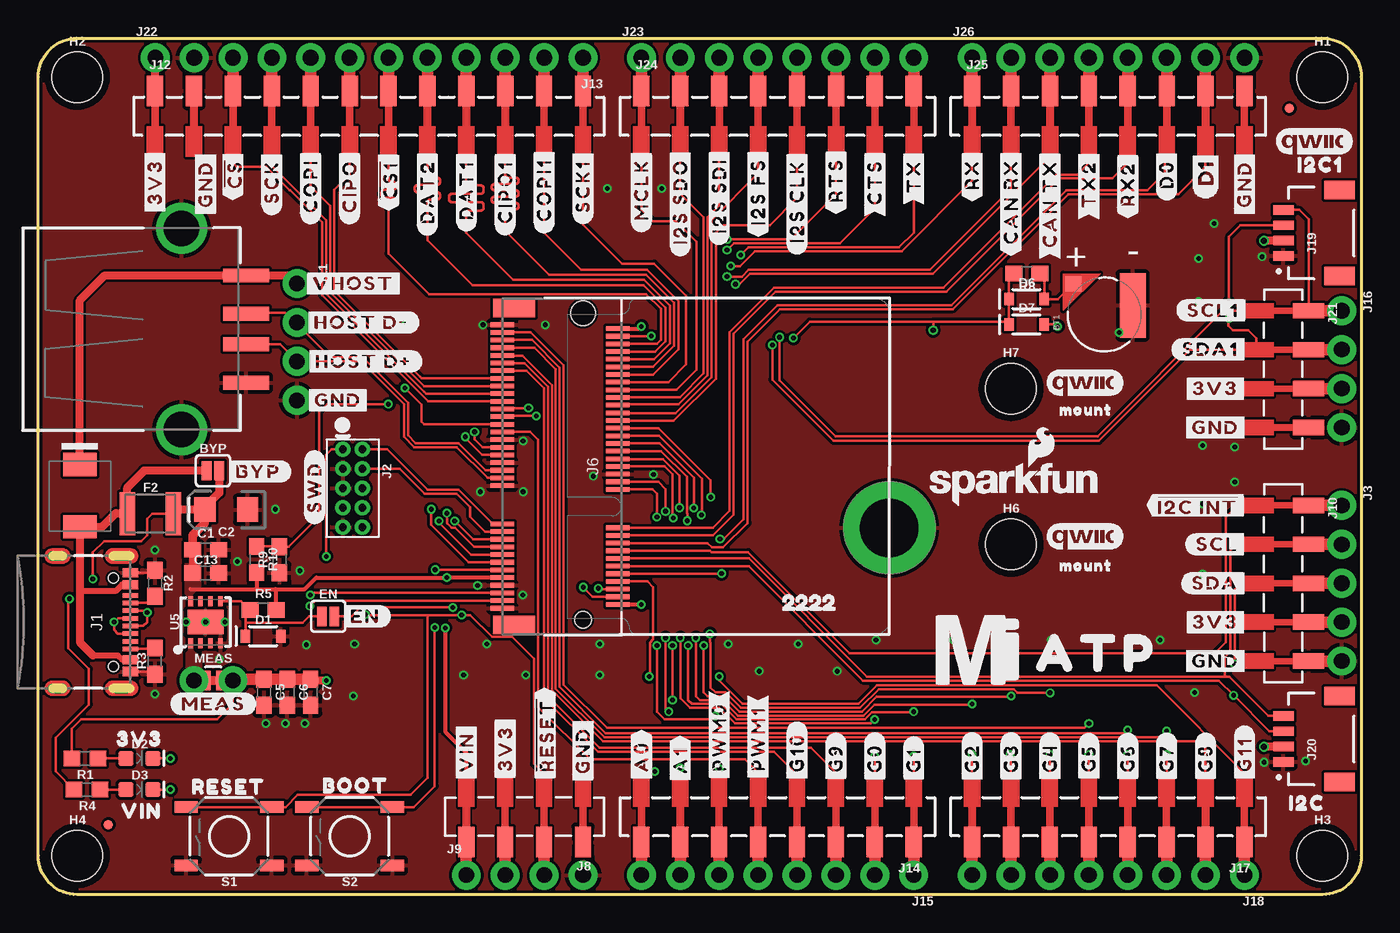
[diagram p1: board, top side]
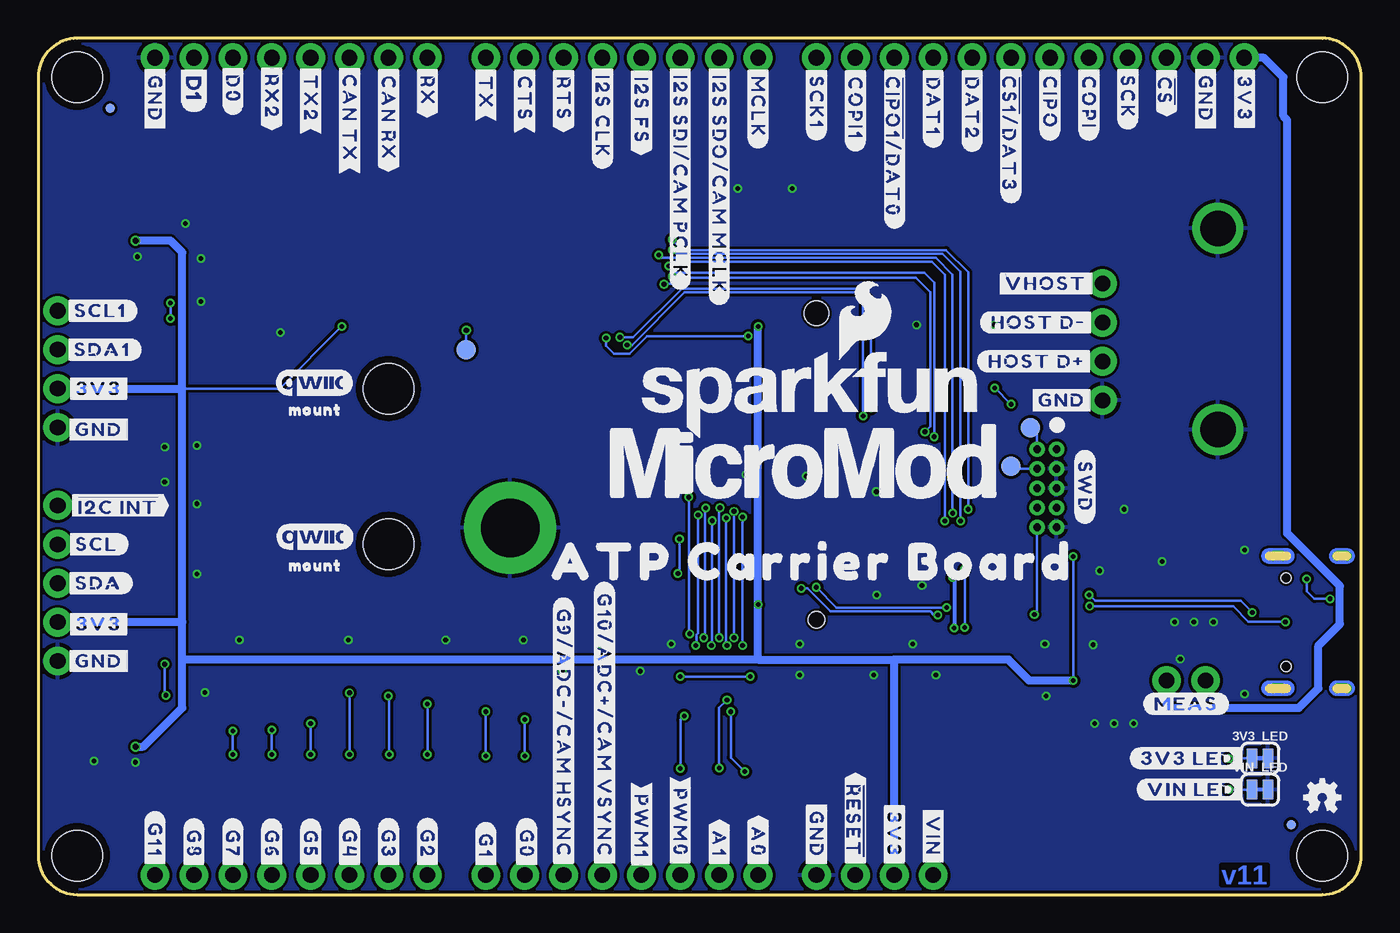
[diagram p2: board, bottom side, seen from below]

Size 86.36 x 55.88 mm. Coordinates in mm from the lower left corner, seen from the top.
Outline: 2.54,55.88 83.82,55.88 arc-90 86.36,53.34 86.36,2.54 arc-90 83.82,0 2.54,0 arc-90 0,2.54 0,53.34 arc-90 2.54,55.88
Copper layers (1*16): Top 0.035mm / dielectric 1.5mm / Bottom 0.035mm
Design rules "SparkFun-2-layer-FAB-LIMIT": minimum track width 4mil, minimum drill 6mil, track to track 4mil, track to pad 4mil, pad to pad 4mil, via to via 4mil, smd to smd 4mil, copper to edge 4mil, drill to drill 4mil, minimum pad ring 5mil, minimum via ring 5mil, stop-mask expansion 4mil, vias tented up to drill 25mil, thermal gap 10mil

### Footprints (pad centres in the part's own frame; a part is rotated, then mirrored left to right if it is on the bottom)
SMT-JUMPER_2_NC_TRACE_SILK = smd 0.66 x 1.27: 1 -0.521,0; 2 0.521,0
ML414H_IV01E = smd 1 x 1: + 2.022,2.032 | smd 4.2 x 1.7: - 0.6,-1.85
SMT-JUMPER_2_NO_SILK = smd 0.635 x 1.27: 1 -0.406,0; 2 0.406,0
0603 = smd 1.1 x 1: 1 -0.85,0; 2 0.85,0
EIA3216 = smd 1.4 x 1.6: + 1.4,0; - -1.4,0
SOD-323 = smd 0.63 x 0.83: A 1.15,0; C -1.15,0
LED-0603 = smd 1 x 1: A -0.877,0; C 0.877,0
DO-214BA = smd 1.52 x 2.21: A -2.032,0; C 2.038,0
1210 = smd 1 x 2.8: 1 -1.5,0; 2 1.5,0
FIDUCIAL-MICRO = smd 0.635 x 0.635: 1 0,0
STAND-OFF = hole 3.302: 0,0
STAND-OFF-REFLOW-M2.5 = drill 3.8 pad 6: 1 0,0
USB-C-16P-2LAYER-PADS = smd 0.3 x 1: A5 -1.25,-0.34; A6 -0.25,-0.34; A7 0.25,-0.34; A8 1.25,-0.34; B5 1.75,-0.34; B6 0.75,-0.34; B7 -0.75,-0.34; B8 -1.75,-0.34 | smd 0.6 x 1: GND -3.225,-0.34; GND2 3.225,-0.34; VBUS1 -2.45,-0.34; VBUS2 2.45,-0.34 | drill 0.4 pad 0.6 long: SHLD1 -4.318,-0.915; SHLD2 4.318,-0.915; SHLD3 -4.318,-5.095; SHLD4 4.318,-5.095 | hole 0.65: -2.89,-1.445; 2.89,-1.445
2X5-PTH-1.27MM = drill 0.508 pad 1: 1 -2.54,-0.635; 2 -2.54,0.635; 3 -1.27,-0.635; 4 -1.27,0.635; 5 0,-0.635; 6 0,0.635; 7 1.27,-0.635; 8 1.27,0.635; 9 2.54,-0.635; 10 2.54,0.635
1X05_NO_SILK = drill 1.016 pad 1.88: 1 0,0; 2 2.54,0; 3 5.08,0; 4 7.62,0; 5 10.16,0
USB-A-S-SILK-FEMALE = smd 3 x 0.9: D+ 7.212,-1; D- 7.212,1; GND 7.212,-3.5; VBUS 7.212,3.5 | drill 2.311: SHLD1 3,-6.566; SHLD2 3,6.566
M.2-CONNECTOR-E = smd 0.3 x 1.55: 1 9.25,-5.275; 2 9,2.275; 3 8.75,-5.275; 4 8.5,2.275; 5 8.25,-5.275; 6 8,2.275; 7 7.75,-5.275; 8 7.5,2.275; 9 7.25,-5.275; 10 7,2.275; 11 6.75,-5.275; 12 6.5,2.275; 13 6.25,-5.275; 14 6,2.275; 15 5.75,-5.275; 16 5.5,2.275; 17 5.25,-5.275; 18 5,2.275; 19 4.75,-5.275; 20 4.5,2.275; 21 4.25,-5.275; 22 4,2.275; 23 3.75,-5.275; 32 1.5,2.275; 33 1.25,-5.275; 34 1,2.275; 35 0.75,-5.275; 36 0.5,2.275; 37 0.25,-5.275; 38 0,2.275; 39 -0.25,-5.275; 40 -0.5,2.275; 41 -0.75,-5.275; 42 -1,2.275; 43 -1.25,-5.275; 44 -1.5,2.275; 45 -1.75,-5.275; 46 -2,2.275; 47 -2.25,-5.275; 48 -2.5,2.275; 49 -2.75,-5.275; 50 -3,2.275; 51 -3.25,-5.275; 52 -3.5,2.275; 53 -3.75,-5.275; 54 -4,2.275; 55 -4.25,-5.275; 56 -4.5,2.275; 57 -4.75,-5.275; 58 -5,2.275; 59 -5.25,-5.275; 60 -5.5,2.275; 61 -5.75,-5.275; 62 -6,2.275; 63 -6.25,-5.275; 64 -6.5,2.275; 65 -6.75,-5.275; 66 -7,2.275; 67 -7.25,-5.275; 68 -7.5,2.275; 69 -7.75,-5.275; 70 -8,2.275; 71 -8.25,-5.275; 72 -8.5,2.275; 73 -8.75,-5.275; 74 -9,2.275; 75 -9.25,-5.275 | smd 1.2 x 2.75: A1 10.35,-4.5; A2 -10.35,-4.5 | hole 1.1: 10,0 | hole 1.6: -10,0
1X04_SMD_VERTICAL_COMBO = smd 1 x 2: 1 0,1.65; 2 2.54,1.65; 3 5.08,1.65; 4 7.62,1.652
1X04_NO_SILK = drill 1.016 pad 1.88: 1 0,0; 2 2.54,0; 3 5.08,0; 4 7.62,0
1X05_SMD_VERTICAL_COMBO = smd 1 x 2: 1 0,1.65; 2 2.54,1.65; 3 5.08,1.65; 4 7.62,1.652; 5 10.16,1.65
1X12_SMD_COMBINED = smd 1 x 2: 1 0,1.65; 2 2.54,1.65; 3 5.08,1.65; 4 7.62,1.652; 5 10.16,1.65; 6 12.7,1.652; 7 15.24,1.65; 8 17.78,1.652; 9 20.32,1.65; 10 22.86,1.652; 11 25.4,1.65; 12 27.94,1.652
1X08_NO_SILK = drill 1.016 pad 1.88: 1 0,0; 2 2.54,0; 3 5.08,0; 4 7.62,0; 5 10.16,0; 6 12.7,0; 7 15.24,0; 8 17.78,0
1X08_SMD_COMBINED = smd 1 x 2: 1 0,1.65; 2 2.54,1.65; 3 5.08,1.65; 4 7.62,1.652; 5 10.16,1.65; 6 12.7,1.652; 7 15.24,1.65; 8 17.78,1.652
JST04_1MM_RA = smd 0.6 x 1.35: 1 -1.5,0; 2 -0.5,0; 3 0.5,0; 4 1.5,0 | smd 1.2 x 2: NC1 2.8,-3.675; NC2 -2.8,-3.675
COMBO-JUMPER_2_NC_TRACE = smd 0.635 x 1.27: 1 -0.508,0; 2 0.508,0 | drill 1.016 pad 1.88: 3 -1.27,0; 4 1.27,0
TACTILE_SWITCH_SMD_5.2MM = smd 1.524 x 0.762: 1 -2.794,1.905; 2 2.794,1.905; 3 -2.794,-1.905; 4 2.794,-1.905
PAD.03X.05 = smd 1.27 x 1.27: P$1 0,0
UDFN-8 = smd 0.3 x 0.65: 1 -0.975,-1.375; 2 -0.325,-1.375; 3 0.325,-1.375; 4 0.975,-1.375; 5 0.975,1.375; 6 0.325,1.375; 7 -0.325,1.375; 8 -0.975,1.375 | smd 2.35 x 1.6: EP 0,0

### Placement (x,y rotation side)
3V3_LED  6.6,8.89 0 bottom
BT1  69.6,37.85 90 top
BYP  11.4,27.66 0 top
C1  10.92,22.5 0 top
C2  12.27,25.12 180 top
C5  14.73,13.21 270 top
C6  16.26,13.21 270 top
C7  17.78,13.21 270 top
C13  10.92,20.98 0 top
D1  14.68,16.87 0 top
D2  6.6,8.89 0 top
D3  6.6,6.86 0 top
D4  2.72,26.04 90 top
D6  64.52,38.86 0 top
D7  64.52,37.21 0 top
EN  18.92,18.16 0 top
F2  7.32,24.87 0 top
FD1  4.57,4.57 0 top
FD2  81.68,51.31 0 top
FD3  4.57,4.57 0 bottom
FD4  81.68,51.31 0 bottom
FRAME1  20.57,-15.75 0 top  (outside the outline)
H1  83.82,53.34 0 top
H2  2.54,53.34 0 top
H3  83.82,2.54 0 top
H4  2.54,2.54 0 top
H5  55.55,23.93 0 top
H6  STAND-OFF  [STAND-OFF]  63.5,22.86 0 top
H7  STAND-OFF  [STAND-OFF]  63.5,33.02 0 top
J1  6.35,17.78 270 top
J2  20.52,26.52 270 top
J3  85.09,25.4 270 top
J4  6.35,36.91 0 top
J6  35.56,27.94 270 top
J8  35.56,5.08 180 top
J9  27.94,1.27 0 top
J10  81.28,25.4 270 top
J11  16.89,39.88 270 top
J12  7.62,50.8 0 top
J13  35.56,54.61 180 top
J14  57.15,5.08 180 top
J15  57.15,1.27 180 top
J16  85.09,38.1 270 top
J17  78.74,5.08 180 top
J18  78.74,1.27 180 top
J19  81.28,43.18 90 top
J20  81.28,10.16 90 top
J21  81.28,38.1 270 top
J22  7.63,54.61 0 top
J23  39.37,54.61 0 top
J24  39.37,50.8 0 top
J25  60.96,50.8 0 top
J26  60.96,54.61 0 top
LOGO1  63.75,26.8 0 top
LOGO2  68.33,23.37 0 bottom
LOGO3  2.54,6.35 0 bottom
LOGO4  SFE_LOGO_NAME_FLAME.2_INCH  [SFE_LOGO_NAME_FLAME_.2]  35.94,32.64 0 bottom
LOGO5  QWIIC_LOGO_3MM  [QWIIC_5MM]  68.31,33.43 0 top
LOGO6  QWIIC_LOGO_3MM  [QWIIC_5MM]  68.31,23.39 0 top
LOGO7  QWIIC_LOGO_3MM  [QWIIC_5MM]  83.28,49.17 0 top
LOGO8  QWIIC_LOGO_3MM  [QWIIC_5MM]  68.36,33.43 0 bottom
MEAS  11.43,13.97 0 top
R1  3.05,8.89 180 top
R2  7.62,20.32 270 top
R3  7.62,15.24 90 top
R4  3.17,6.86 180 top
R5  14.68,18.57 0 top
R8  64.54,40.54 180 top
R9  15.75,21.84 90 top
R10  14.25,21.87 270 top
S1  12.45,3.81 180 top
S2  20.32,3.81 180 top
TP1  58.42,35.56 0 bottom
TP2  21.59,30.48 0 bottom
TP3  22.86,27.94 0 bottom
U5  10.92,17.78 0 top
U$1  [#A0#10]  39.37,9.02 90 top
U$2  [#A1#10]  41.91,8.76 90 top
U$3  [#GND#0]  76.83,15.24 0 top
U$4  [#G0#2]  54.61,8.89 90 top
U$5  [#RESET10]  12.42,7.17 0 top
U$6  [#D0#0]  73.66,46.99 90 top
U$7  [#G1#2]  57.15,8.76 90 top
U$8  [#G2#2]  60.96,8.89 90 top
U$9  [#G3#3]  63.5,8.89 90 top
U$10  [#G4#4]  66.04,8.89 90 top
U$11  [#G5#5]  68.58,8.89 90 top
U$12  [#G6#6]  71.12,8.89 90 top
U$13  [#G7#7]  73.66,8.89 90 top
U$14  [#G8#8]  76.2,8.89 90 top
U$15  [#G9#9]  52.07,8.89 90 top
U$16  [#G10#10]  49.53,9.27 90 top
U$17  [#G11#10]  78.74,9.14 90 top
U$18  [#PWM0#10]  44.45,10.29 90 top
U$19  [#PWM1#10]  46.99,10.16 90 top
U$20  [##CS1##5178039]  22.86,46.61 90 top
U$21  [##I2C_INT##10]  75.69,25.4 0 top
U$22  [#CAN_RX#9]  63.5,45.21 90 top
U$23  [#CAN_TX#10]  66.04,45.09 90 top
U$24  [#CIPO#3]  20.32,46.23 90 top
U$25  [#COPI#2]  17.78,46.23 90 top
U$26  [#CTS#6]  54.61,46.48 90 top
U$27  [#GND#0]  35.56,9.4 90 top
U$28  [#SCK#2]  15.24,46.48 90 top
U$29  [#I2S_FS#5]  46.99,45.85 90 top
U$30  [#I2S_SDI#5]  44.45,45.59 90 top
U$31  [#I2S_SDO#5]  41.91,45.21 90 top
U$32  [#MCLK#4]  39.37,45.97 90 top
U$33  [#RTS#5]  52.07,46.61 90 top
U$34  [#RX#8]  60.96,46.99 90 top
U$35  [#TX#7]  57.15,46.86 90 top
U$36  [#DAT1#5178039]  27.94,45.97 90 top
U$37  [##RESET##7]  33.07,10.39 90 top
U$38  [#3V3#1]  30.48,9.53 90 top
U$39  [#BYP#8]  14.35,27.61 0 top
U$40  [#HOST_D##9]  21.21,34.8 0 top
U$41  [#HOST_D##10]  21.08,37.34 0 top
U$42  [#MEAS#10]  11.43,12.45 0 top
U$43  [BOOT10]  20.7,7.11 0 top
U$44  [#SDA#4]  76.83,20.32 0 top
U$45  [#VIN#6]  27.94,9.27 90 top
U$46  [#GND#0]  19.56,32.26 0 top
U$47  [#GND#0]  76.83,30.48 0 top
U$48  [#EN#0]  21.34,18.16 0 top
U$49  [#SCL#5]  76.96,22.86 0 top
U$50  [#VHOST#0]  20.57,39.88 0 bottom
U$51  [#SWD#10]  18.03,26.58 90 top
U$52  [#I2S_CLK#5]  49.53,45.21 90 top
U$53  [#DAT2#5178039]  25.4,45.85 90 top
U$54  [#CIPO1#5178039]  30.48,45.85 90 top
U$55  [22229]  47.62,19.05 0 top
U$56  [##CIPO1##DAT0#5178038]  30.45,48.81 270 bottom
U$57  [#COPI1#2]  33.02,45.97 90 top
U$58  [#GND#0]  78.74,46.35 90 top
U$59  [##CS##0]  12.7,46.99 90 top
U$60  [#3V3#1]  76.83,33.02 0 top
U$61  [#3V3#1]  7.62,46.48 90 top
U$62  [ATP0]  69.09,15.75 0 top
U$63  [#RX2#3]  71.12,46.35 90 top
U$64  [#TX2#2]  68.58,46.35 90 top
U$65  [#SCL1#3]  76.71,38.13 0 top
U$66  [#SDA1#3]  76.53,35.59 0 top
U$67  [#SCK1#2]  35.56,46.23 90 top
U$68  [VIN3]  6.73,5.46 0 top
U$69  [3V34]  6.6,10.16 0 top
U$70  [#3V3#1]  76.83,17.78 0 top
U$71  [I2C4]  82.8,5.97 0 top
U$72  [I2C14]  83.69,47.62 0 top
U$73  [ATP_CARRIER_BOARD1]  35.81,21.72 0 bottom
U$75  [#COPI1#2]  33.02,51.31 270 bottom
U$76  [#RX2#3]  71.12,52.07 270 bottom
U$77  [#SCK1#2]  35.56,51.69 270 bottom
U$78  [#SCL1#3]  82.3,38.1 0 bottom
U$79  [#SDA1#3]  82.17,35.56 0 bottom
U$80  [#TX2#2]  68.58,51.94 270 bottom
U$81  [##CS##5178037]  12.7,52.45 270 bottom
U$82  [#DAT2#5]  25.4,51.31 270 bottom
U$83  [#DAT1#5]  27.94,51.44 270 bottom
U$84  [##CS1##DAT3#5178037]  22.86,49.66 270 bottom
U$85  [#COPI#4]  17.78,51.69 270 bottom
U$86  [#SCK#4]  15.24,52.07 270 bottom
U$87  [#MCLK#6]  39.37,51.44 270 bottom
U$88  [#3V3#1]  7.62,51.94 270 bottom
U$89  [#GND#0]  10.92,46.35 90 top
U$90  [#I2S_FS#7]  46.99,51.18 270 bottom
U$91  [#I2S_CLK#7]  49.53,50.8 270 bottom
U$92  [#RTS#7]  52.07,51.94 270 bottom
U$93  [#CTS#8]  54.61,51.94 270 bottom
U$94  [#TX#9]  57.15,52.32 270 bottom
U$95  [#RX#10]  60.96,52.45 270 bottom
U$96  [#CAN_RX#10]  63.5,50.67 270 bottom
U$97  [#CAN_TX#10]  66.04,50.67 270 bottom
U$98  [#D0#0]  73.66,52.58 270 bottom
U$99  [D10]  76.2,45.34 90 top
U$100  [#GND#0]  78.74,51.94 270 bottom
U$101  [#GND#0]  82.42,30.35 0 bottom
U$102  [#GND#0]  82.42,15.24 0 bottom
U$103  [#GND#0]  35.56,3.94 270 bottom
U$104  [#GND#0]  10.16,51.94 270 bottom
U$105  [#GND#0]  19.56,32.26 0 bottom
U$106  [#3V3#1]  82.42,33.02 0 bottom
U$107  [#3V3#1]  82.42,17.65 0 bottom
U$108  [#SDA#4]  82.42,20.32 0 bottom
U$109  [#SCL#5]  82.55,22.86 0 bottom
U$110  [##I2C_INT##10]  81.15,25.4 0 bottom
U$111  [#G11#10]  78.74,3.56 270 bottom
U$112  [#G8#8]  76.2,3.3 270 bottom
U$113  [#G7#7]  73.66,3.3 270 bottom
U$114  [#G6#6]  71.12,3.3 270 bottom
U$115  [#G5#5]  68.58,3.3 270 bottom
U$116  [#G4#4]  66.04,3.3 270 bottom
U$117  [#G3#3]  63.5,3.3 270 bottom
U$118  [#G2#2]  60.96,3.3 270 bottom
U$119  [#G1#2]  57.15,3.17 270 bottom
U$120  [#G0#2]  54.48,3.3 270 bottom
U$121  [#PWM0#10]  44.45,4.7 270 bottom
U$122  [#PWM1#10]  46.99,4.45 270 bottom
U$123  [#A0#10]  39.37,3.43 270 bottom
U$124  [#A1#10]  41.91,3.3 270 bottom
U$125  [##RESET##7]  33.02,4.83 270 bottom
U$126  [#3V3#1]  30.48,3.94 270 bottom
U$127  [#VIN#6]  27.94,3.81 270 bottom
U$128  [#HOST_D##9]  21.21,34.8 0 bottom
U$129  [#HOST_D##10]  21.08,37.34 0 bottom
U$131  [#SWD#10]  18.03,26.61 270 bottom
U$132  [#MEAS#10]  11.43,12.45 0 bottom
U$133  [#VIN_LED#10]  11.05,6.86 0 bottom
U$134  [#3V3_LED#10]  11.3,8.89 0 bottom
U$135  [#G9#ADC##CAM_HSYNC#9]  52.07,10.54 270 bottom
U$136  [#G10#ADC##CAM_VSYNC#10]  49.4,11.05 270 bottom
U$137  [#I2S_SDI#CAM_PCLK#7]  44.45,46.86 270 bottom
U$138  [#I2S_SDO#CAM_MCLK#7]  41.91,46.35 270 bottom
U$139  [MOUNT10]  68.39,31.64 0 top
U$140  [MICROMOD_MI_LOGO_1]  61.34,16 0 top
U$141  [MOUNT10]  68.39,21.48 0 top
U$142  [MOUNT10]  68.29,21.48 0 bottom
U$143  [MOUNT10]  68.29,31.64 0 bottom
U$144  [MICROMOD_LOGO_1]  36.45,28.32 0 bottom
U$145  [D10]  76.2,54.36 270 bottom
U$146  [#VHOST#0]  20.57,39.88 0 top
U$147  [#CIPO#5178038]  20.32,51.69 270 bottom
VIN_LED  6.6,6.86 0 bottom

### Tracks (layer width: path | path; a pad name or v marks a point on that pad's centre or on a via)
3.3V  (via drill 0.3, 0.38)
  Top 0.152: v66.55,37.08 66.42,37.21 D7.A | J2.1 19.15,29.06 18.8,28.7 v18.8,22.07
  Top 0.178: MEAS.2 MEAS.4 12.7,12.45 11.68,11.43 2.79,11.43 2.2,10.83 R1.2
  Top 0.254: J6.2 39.35,18.94 v39.37,18.92 | J6.74 39.23,36.94 v39.37,37.08
  Top 0.508: v18.8,13.97 17.87,13.97 C7.1 | J12.1 7.62,54.59 J22.1 | J20.2 v80.02,9.66 v80.01,9.65 | J19.2 v80.02,42.68 v80.01,42.67
  Top 0.762: J16.3 J21.3 | MEAS.4 12.79,14.06 C5.1 C6.1 C7.1 | J10.4 J3.4 | J8.3 J9.2
  Bottom 0.152: v18.8,13.97 v18.8,22.07 | v66.55,37.08 70.61,33.02 76.96,33.02
  Bottom 0.508: 39.37,15.33 30.48,15.33 | 39.37,15.33 76.96,15.33 | J9.2 30.48,15.33 | 39.37,15.33 v39.37,18.92 v39.37,37.08 | MEAS.4 12.7,12.45 12.45,12.19 4.06,12.19 2.79,13.46 2.79,16.25 1.4,17.64 1.4,20.15 4.83,23.58 4.83,50.55 5.08,50.8 5.08,53.34 6.35,54.61 J22.1 | v18.8,13.97 21.67,13.97 23.02,15.33 30.48,15.33 | 76.96,15.33 76.96,12.19 79.5,9.65 v80.01,9.65 | v80.01,42.67 77.72,42.67 76.96,41.91 76.96,33.02 | 76.96,15.33 76.96,17.78 | 76.96,17.78 76.96,33.02 | J16.3 76.96,33.02 | 76.96,17.78 J3.4
3.3V_EN
  Top 0.152: U5.5 13.24,19.16 13.66,18.74 | 13.66,18.74 R5.1 | D1.C 13.53,17.73 | 13.53,17.73 13.53,18.61 13.66,18.74 | 13.53,17.73 13.54,17.74 17.27,17.74 17.7,18.16 EN.1
!BOOT!  (via drill 0.3)
  Top 0.152: S2.4 S2.3 24.51,5.71 25.88,7.09 v25.88,17.42 | v25.91,21.2 30.28,21.2 J6.11
  Bottom 0.152: v25.88,17.42 25.88,21.17 v25.91,21.2
!CS1!/DAT3
  Top 0.152: 22.86,52.07 22.86,46.74 arc90 23.06,46.53 23.13,46.53 arc-90 23.33,46.33 23.33,46.2 arc-90 23.13,46 22.59,46 arc90 22.39,45.8 22.39,45.67 arc90 22.59,45.47 23.13,45.47 arc-90 23.33,45.26 23.33,45.14 arc-90 23.13,44.94 23.06,44.94 arc90 22.86,44.73 22.86,41.83 25.51,39.18 39.69,39.18 40.64,38.23 40.64,36.2 40.38,35.94 J6.70 | J12.7 J13.6
  Top 0.762: 22.86,52.07 J13.6
!CS!
  Top 0.152: 12.7,52.07 12.7,47.75 12.95,47.5 14.88,47.5 16.41,45.97 16.43,45.97 18.52,43.88 18.52,39.13 25.45,32.19 J6.55 | J12.3 12.7,54.59 J22.3
  Top 0.762: J22.3 12.71,52.09 12.7,52.07
!RESET  (via drill 0.3)
  Top 0.152: S1.4 S1.3 16.13,5.71 16.94,6.53 24.31,6.53 25.4,7.62 25.4,18.24 | v21.34,18.29 21.39,18.24 25.4,18.24 | J6.6 36.6,19.94 v36.55,19.99 | 25.4,18.24 v27.64,18.24 28.19,18.24 29.61,16.81 30.94,16.81 32.36,15.39 32.36,8.53 33.02,7.87 33.02,3.81 J8.2
  Top 0.508: J9.3 33.02,3.81
  Top 0.762: J8.2 J9.3
  Bottom 0.152: J2.10 21.16,18.47 v21.34,18.29 | v36.55,19.99 36.14,19.99 34.63,18.48 28.13,18.48 27.89,18.24 v27.64,18.24
A0  (via drill 0.3)
  Top 0.152: J6.34 40.48,26.94 40.95,26.47 v40.95,25.02 v40.95,25.01 | v40.95,16.76 40.95,12.14 v41.15,11.94 | J14.8 39.37,7.16 v40.23,8.03
  Top 0.762: J14.8 J15.8
  Bottom 0.152: v40.95,25.01 v40.95,16.76 | v41.15,11.94 41.15,8.94 v40.23,8.03
A1  (via drill 0.3)
  Top 0.152: J6.38 40.89,27.94 41.4,27.43 41.4,24.64 v41.45,24.59 | v41.4,12.7 v41.4,16.26 | J14.7 v41.91,8.26
  Top 0.762: J14.7 J15.7
  Bottom 0.152: v41.45,24.59 41.45,16.31 v41.4,16.26 | v41.91,8.26 41.91,12.19 v41.4,12.7
CAN_RXI  (via drill 0.3)
  Top 0.152: J6.41 28.97,28.69 27.83,29.83 v27.87,29.88 | v44.96,40.34 45.92,40.34 46.35,40.76 58.22,40.76 63.5,46.05 63.5,52.07 | J25.2 J26.2
  Top 0.762: 63.5,52.07 J26.2
  Bottom 0.152: v27.87,29.88 27.87,39.94 28.52,40.59 44.7,40.59 v44.96,40.34
CAN_TXO  (via drill 0.3)
  Top 0.152: J6.43 29.01,29.19 28.48,29.72 v28.48,30.2 | v45.51,39.83 45.77,39.83 46.46,40.51 58.4,40.51 66.04,48.16 66.04,52.07 | J25.3 J26.3
  Top 0.762: 66.04,52.07 J26.3
  Bottom 0.152: v28.48,30.2 28.12,30.56 28.12,39.32 29.06,40.26 44.23,40.26 44.61,39.88 45.47,39.88 v45.51,39.83
CIPO
  Top 0.152: J12.6 20.32,46.99 19.32,45.99 19.32,39.41 24.92,33.81 25.03,33.69 J6.61
  Top 0.762: J12.6 J13.7
CIPO1/DAT0
  Top 0.152: J12.10 J13.3 | J6.64 40.13,34.44 41.5,35.81 41.5,38.61 39.67,40.44 33.35,40.44 30.48,43.31 30.48,44.52 arc-90 30.68,44.73 31.16,44.73 arc90 31.37,44.93 31.37,44.93 arc90 31.16,45.14 29.8,45.14 arc-90 29.59,45.34 29.59,45.35 arc-90 29.8,45.55 31.16,45.55 arc90 31.37,45.75 31.37,45.76 arc90 31.16,45.96 29.8,45.96 arc-90 29.59,46.16 29.59,46.17 arc-90 29.8,46.37 31.16,46.37 arc90 31.37,46.58 31.37,46.58 arc90 31.16,46.79 30.68,46.79 arc-90 30.48,46.99 30.48,50.48 30.5,50.5 30.5,52.05 30.48,52.07
  Top 0.762: 30.48,52.07 J13.3
COPI
  Top 0.152: J12.5 17.78,46.23 19.06,44.95 19.06,39.3 25.17,33.19 J6.59
  Top 0.762: J12.5 J13.8
COPI1
  Top 0.152: 33.02,52.07 33.02,43.18 35.43,40.77 39.75,40.77 41.78,38.73 41.78,35.59 40.14,33.94 J6.62 | J12.11 J13.2
  Top 0.762: 33.02,52.07 J13.2
CTS1  (via drill 0.3)
  Top 0.152: J6.15 28.25,22.19 26.16,24.28 v26.16,24.38 | v44.96,42.06 45.41,42.52 52.32,42.52 54.61,44.81 54.61,52.07 | J24.7 J23.7
  Top 0.762: 54.61,52.07 J23.7
  Bottom 0.152: v26.16,24.38 26.16,40.64 27.33,41.81 44.71,41.81 v44.96,42.06
D0  (via drill 0.3)
  Top 0.152: J6.10 44.59,20.94 v44.6,20.95 | v44.5,23.22 44.76,23.22 46.02,24.49 46.02,36.23 48.25,38.46 59.6,38.46 67.12,45.97 72.39,45.97 73.53,47.12 73.53,52.33 J25.6
  Top 0.762: J25.6 J26.6
  Bottom 0.152: v44.5,23.22 44.5,21.06 v44.6,20.95
D1
  Top 0.152: 37.87,22.91 J6.18 43.7,22.94 43.99,22.65 44.71,22.65 46.3,24.25 46.3,36.09 48.42,38.2 59.72,38.2 67.24,45.72 74.42,45.72 76.2,47.5 J25.7
  Top 0.762: J25.7 J26.7
DAT1
  Top 0.152: J6.66 40.2,34.94 41.24,35.98 41.24,38.44 39.55,40.13 30.99,40.13 27.94,43.18 27.94,44.44 arc-90 28.14,44.64 28.88,44.64 arc90 29.08,44.85 29.08,44.98 arc90 28.88,45.19 27,45.19 arc-90 26.8,45.39 26.8,45.53 arc-90 27,45.73 28.88,45.73 arc90 29.08,45.94 29.08,46.08 arc90 28.88,46.28 28.14,46.28 arc-90 27.94,46.48 27.94,52.07 | J12.9 J13.4
  Top 0.762: 27.94,52.07 J13.4
DAT2
  Top 0.152: J6.68 40.27,35.44 40.95,36.12 40.95,38.3 39.5,39.75 28.35,39.75 25.4,42.7 25.4,45.16 arc-90 25.6,45.36 26.02,45.36 arc90 26.23,45.56 26.23,45.63 arc90 26.02,45.84 24.78,45.84 arc-90 24.57,46.04 24.57,46.11 arc-90 24.78,46.31 26.02,46.31 arc90 26.23,46.51 26.23,46.58 arc90 26.02,46.79 25.6,46.79 arc-90 25.4,46.99 25.4,52.07 | J12.8 J13.5
  Top 0.762: 25.4,52.07 J13.5
G0  (via drill 0.3)
  Top 0.152: J6.40 37.85,28.42 40.77,28.42 41.86,27.33 v41.86,25.25 | v41.91,16.76 41.91,12.83 42.55,12.19 44.45,12.19 45.47,11.18 54.36,11.18 v54.61,11.43 | v54.61,9.05 J14.2
  Top 0.762: J14.2 J15.2
  Bottom 0.152: v41.86,25.25 41.91,25.2 v41.91,16.76 | v54.61,11.43 v54.61,9.05
G1  (via drill 0.3)
  Top 0.152: J6.42 40.66,28.95 42.34,27.26 42.34,24.89 42.37,24.87 v42.37,24.4 | v42.42,16.26 42.42,12.7 42.67,12.45 44.55,12.45 45.57,11.43 53.96,11.43 54.42,11.89 57.1,11.89 v57.15,11.94 | v57.15,9.05 57.15,3.12 | J14.1 J15.1
  Top 0.762: 57.15,3.12 J15.1
  Bottom 0.152: v42.37,24.4 42.37,16.31 v42.42,16.26 | v57.15,11.94 v57.15,9.05
G2  (via drill 0.3)
  Top 0.152: v42.8,25.22 42.8,27.21 40.57,29.45 J6.44 | v42.93,16.76 42.93,12.95 43.18,12.7 44.66,12.7 45.68,11.68 53.86,11.68 54.57,12.39 60.91,12.39 v60.96,12.45 | v60.96,9.14 J17.8
  Top 0.762: J18.8 J17.8
  Bottom 0.152: v42.8,25.22 42.82,25.2 42.82,16.87 v42.93,16.76 | v60.96,12.45 v60.96,9.14
G3  (via drill 0.3)
  Top 0.152: J6.46 40.53,29.95 43.33,27.14 43.33,24.82 v43.29,24.78 | v43.43,16.26 43.43,13.21 43.69,12.95 44.77,12.95 45.78,11.94 53.75,11.94 54.72,12.9 63.45,12.9 v63.5,12.95 | v63.45,9.14 63.5,9.09 J17.7
  Top 0.762: J17.7 J18.7
  Bottom 0.152: v43.29,24.78 43.29,17.05 43.38,16.95 43.38,16.31 v43.43,16.26 | v63.5,12.95 63.45,12.9 v63.45,9.14
G4  (via drill 0.3)
  Top 0.152: J6.48 40.48,30.44 43.89,27.03 v43.89,25.93 | v43.84,17.02 43.84,16.5 43.89,16.45 43.89,13.51 44.2,13.21 44.87,13.21 45.89,12.19 53.65,12.19 54.87,13.41 63.69,13.41 63.93,13.17 v66.04,13.17 | v66.04,9.14 J17.6
  Top 0.762: J18.6 J17.6
  Bottom 0.152: v43.89,25.93 43.89,17.07 v43.84,17.02 | v66.04,13.17 v66.04,9.14
G5  (via drill 0.3)
  Top 0.152: J6.73 32.14,36.69 34.29,34.54 34.29,13.71 37.12,10.88 68.28,10.88 v68.58,11.18 | v68.58,9.14 J17.5
  Top 0.762: J17.5 J18.5
  Bottom 0.152: v68.58,9.14 v68.58,11.18
G6  (via drill 0.3)
  Top 0.152: J6.71 32.24,36.2 34.04,34.4 34.04,13.55 37.04,10.54 70.92,10.54 v71.12,10.75 | v71.12,9.14 J17.4
  Top 0.762: J17.4 J18.4
  Bottom 0.152: v71.12,9.14 v71.12,10.75
G7  (via drill 0.3)
  Top 0.152: J6.69 32.38,35.69 33.78,34.29 33.78,13.44 36.96,10.27 73.26,10.27 v73.66,10.67 | v73.66,9.14 J17.3
  Top 0.762: J17.3 J18.3
  Bottom 0.152: v73.66,10.67 v73.66,9.14
G8
  Top 0.152: J6.67 30.3,35.17 31.61,35.17 33.53,33.26 33.53,13.34 36.86,10.01 75.84,10.01 76.2,9.65 J17.2
  Top 0.762: J17.2 J18.2
G9/ADC_N
  Top 0.152: J6.65 31.73,34.69 33.27,33.15 33.27,12.95 36.65,9.58 50.44,9.58 52.07,7.95 J14.3
  Top 0.762: J14.3 J15.3
G10/ADC_P
  Top 0.152: J6.63 31.88,34.19 33.02,33.05 33.02,12.83 36.52,9.32 48.03,9.32 49.53,7.82 J14.4
  Top 0.762: J14.4 J15.4
G11  (via drill 0.3)
  Top 0.152: J6.8 39.76,20.44 40.13,20.07 40.13,16.65 39.93,16.45 39.93,14.28 v39.88,14.22 | v44.45,14.22 44.45,13.99 45.98,12.46 53.55,12.46 54.76,13.66 73,13.66 78.74,7.93 J17.1
  Top 0.762: J18.1 J17.1
  Bottom 0.152: v39.88,14.22 v44.45,14.22
GND  (via drill 0.3)
  Top 0.178: J1.GND 7.46,21 R2.1 | J1.GND2 7.46,14.55 R3.1
  Top 0.762: J10.5 J3.5
  other vias: 7.62,13.08 11.81,15.37 10.92,17.78 12.19,17.78 9.65,17.78 17.5,16.31 14.86,11.18 16.13,11.18 17.4,11.18 17.07,21.13 13,21.74 15.48,25.15 7.62,22.48 40.16,27.41 31.65,29.59 31.62,19.56 28.68,20.17 29.03,37.19 36.22,27.3 33.1,37.19 70.56,36.68 73.23,16.61 66.12,16.61 59.77,16.61 54.69,16.61 49.61,16.36 45.03,16.36 47.07,14.58 52.15,14.58 36.65,14.33 36.65,16.36 29.29,16.36 31.83,14.33 27.76,14.33 20.57,12.95 20.65,16.36 80.01,8.64 82.73,8.71 76,25.5 76,29.31 76,20.93 75.49,13.18 75.74,38.71 75.74,41.5 76.76,43.79 79.88,41.63 37.13,46.08 40.69,46.08 23.95,37.19 31.65,26.29 28.85,26.29 78.11,26.92 78.11,29.21
  pour Bottom (isolate 0.178): 0,55.88 86.38,55.88 86.38,0 0,0
  pour Top (isolate 0.178, rank 4): 0,55.88 86.38,55.88 86.38,0 0,0
I2C_!INT
  Top 0.152: J6.16 43.84,22.44 43.94,22.35 46.34,22.35 52.94,15.75 76.81,15.75 77.52,16.46 77.52,24.61 78.31,25.4 J10.1
  Top 0.762: J10.1 J3.1
I2S_CLK
  Top 0.152: J6.50 37.87,30.91 41.48,30.91 44.25,33.68 44.25,43.18 44.76,43.69 47.75,43.69 49.53,45.47 J24.5
  Top 0.762: J24.5 J23.5
I2S_SDI
  Top 0.152: J6.54 37.88,31.98 41.8,31.98 43.69,33.88 43.69,44.2 44.45,44.96 44.45,52.07 | J24.3 J23.3
  Top 0.762: 44.45,52.07 J23.3
I2S_SDO
  Top 0.152: J6.56 37.85,32.46 41.89,32.46 43.43,34.01 43.43,44.2 41.9,45.73 41.9,52.07 | J24.2 J23.2
  Top 0.762: J23.2 41.91,52.08 41.9,52.07
I2S_WS
  Top 0.152: J6.52 37.85,31.42 41.6,31.42 43.94,33.76 43.94,44.02 46.99,47.07 46.99,52.07 | J24.4 J23.4
  Top 0.762: 46.99,52.07 J23.4
MCLK
  Top 0.152: J6.58 41.65,32.94 42.98,34.27 42.98,42.6 41.63,43.94 40.13,43.94 39.37,44.7 39.37,52.07 | J24.1 J23.1
  Top 0.762: 39.37,52.07 J23.1
N$1
  Top 0.178: R1.1 D2.A
N$2
  Top 0.178: R4.1 D3.A
N$3  (via drill 0.3)
  Top 0.178: D2.C v8.64,8.89
  Bottom 0.178: v8.64,8.89 3V3_LED.1
N$4  (via drill 0.3)
  Top 0.178: D3.C v8.64,6.86
  Bottom 0.178: v8.64,6.86 VIN_LED.1
N$5  (via drill 0.3)
  Top 0.152: J6.4 36.19,19.44 v35.57,20.06 | v27.05,18.73 27.04,18.75 21.03,18.75 20.45,18.16 EN.2
  Bottom 0.152: v35.57,20.06 34.24,18.73 v27.05,18.73
N$7
  Top 0.508: J11.1 16.36,40.41 J4.VBUS 4.34,40.41 2.72,38.79 D4.C
N$10
  Top 0.178: J1.A5 7.18,19.03 R2.2
N$11
  Top 0.178: J1.B5 7.56,16.03 R3.2
N$14
  Top 0.152: D6.A 66.56,38.86 BT1.+
  Top 0.178: R8.1 65.67,40.26 D6.A
OUT_MEAS
  Top 0.178: MEAS.3 MEAS.1
  pour Top (isolate 0.305, no thermals): 9.8,16.71 10.08,16.71 10.08,15.98 10.67,15.39 10.67,13.21 9.65,13.21 9.65,15.8 9.8,15.95
PWM0  (via drill 0.3)
  Top 0.152: J6.32 40.11,26.44 40.39,26.16 v40.39,24.64 | v40.39,16.26 40.39,11.94 40.89,11.43 43.97,11.43 v44.2,11.66 | J14.6 v44.45,8.23
  Top 0.762: J14.6 J15.6
  Bottom 0.152: v40.39,24.64 v40.39,16.26 | v44.2,11.66 44.45,11.4 v44.45,8.23
PWM1
  Top 0.152: J6.47 32.12,30.19 32.64,29.67 32.64,12.24 36.04,8.84 46.13,8.84 46.99,7.98 J14.5
  Top 0.762: J14.5 J15.5
RTC_3V  (via drill 0.3, 0.35)
  Top 0.152: J6.72 40,36.44 v40.01,36.45 | D7.C 63.19,37.39 58.42,37.39 | v49.3,36.32 50.36,37.39 58.42,37.39 | 58.42,37.39 v58.42,36.83
  Top 0.178: D7.C D6.C 63.37,40.09 63.75,40.48 R8.2
  Bottom 0.152: v40.01,36.45 46.61,36.45 47.75,35.31 48.77,35.31 49.3,35.83 v49.3,36.32 | v58.42,36.83 TP1.P$1
RTS1  (via drill 0.3)
  Top 0.152: J6.13 28.09,21.69 25.65,24.13 v25.65,25.15 | v44.98,42.75 45.01,42.77 49.12,42.77 52.07,45.72 J24.6
  Top 0.762: J24.6 J23.6
  Bottom 0.152: v25.65,25.15 25.65,40.62 27.1,42.06 44.3,42.06 v44.98,42.75
RX1  (via drill 0.3)
  Top 0.152: J6.19 28.37,23.19 v27.18,24.38 | v45.21,41.02 45.82,41.02 46.78,41.98 56.36,41.98 60.96,46.58 60.96,52.07 | J25.1 J26.1
  Top 0.762: 60.96,52.07 J26.1
  Bottom 0.152: v27.18,24.38 27.18,40.44 28.04,41.3 44.77,41.3 45.05,41.02 v45.21,41.02
RX2
  Top 0.152: J6.20 44.04,23.44 45.39,24.79 45.39,36.6 48.14,39.34 59.27,39.34 66.66,46.74 70.1,46.74 71.12,47.75 71.12,52.07 | J25.5 J26.5
  Top 0.762: 71.12,52.07 J26.5
SCK
  Top 0.152: 15.24,52.07 15.24,47.55 18.79,43.99 18.79,39.21 25.19,32.81 25.31,32.69 J6.57 | J12.4 15.24,54.59
  Top 0.762: J22.4 15.24,54.59 15.24,52.07
SCK1
  Top 0.152: 35.56,52.07 35.56,43.71 38.1,41.17 40.21,41.17 42.29,39.09 42.29,34.59 41.14,33.44 J6.60 | J12.12 J13.1
  Top 0.762: 35.56,52.07 J13.1
SCL
  Top 0.152: J6.14 46.39,21.94 54.1,14.22 77.47,14.22 | 77.47,14.22 77.74,14.22 80.31,11.66 J20.4 | J10.2 78.23,22.86 77.83,22.45 77.83,15.85 77.47,15.49 77.47,14.22
  Top 0.762: J10.2 J3.2
SCL1  (via drill 0.3)
  Top 0.152: J6.53 30.34,31.75 v32,31.75 | J21.1 77.33,38.1 69.15,29.92 52.05,29.92 48.39,33.58 v48.39,36.37 | J21.1 82.93,44.07 82.32,44.68 J19.4
  Top 0.762: J16.1 J21.1 J16.1
  Bottom 0.152: v32,31.75 32,38.84 32.72,39.55 44.35,39.55 47.52,36.37 v48.39,36.37
SDA  (via drill 0.3)
  Top 0.152: J6.12 46.38,21.44 53.85,13.97 77.06,13.97 v78.03,13.01 80.37,10.66 J20.3 | J10.3 78.51,20.32 78.11,19.91 v78.11,15.04
  Top 0.762: J10.3 J3.3
  Bottom 0.152: v78.11,15.04 78.11,13.08 v78.03,13.01
SDA1  (via drill 0.3)
  Top 0.152: J6.51 30.34,31.24 v32.51,31.24 | v47.92,35.87 47.92,33.61 51.92,29.61 69.24,29.61 75.18,35.56 79.38,35.56 | v77.72,37.59 77.7,37.62 77.7,37.11 77.98,36.83 78.99,36.83 79.5,36.32 79.5,35.69 79.38,35.56 | 79.38,35.56 82.55,35.56 | J19.3 78.48,43.68 77.72,42.93 v77.72,38.61
  Top 0.762: 82.55,35.56 J16.2 J21.2
  Bottom 0.152: v32.51,31.24 32.51,38.94 32.86,39.29 44.17,39.29 47.6,35.87 v47.92,35.87 | v77.72,37.59 v77.72,38.61
SWDCK
  Top 0.152: J6.21 29.16,23.69 28.19,24.66 28.19,25.27 27.3,26.16 25.22,26.16 23.6,27.79 J2.4
  Bottom 0.152: TP3.P$1 22.71,27.79 J2.4
SWDIO
  Top 0.152: J6.23 29.66,24.19 27.43,26.42 25.4,26.42 22.76,29.06 J2.2
  Bottom 0.152: J2.2 21.16,30.05 TP2.P$1
TX1  (via drill 0.3)
  Top 0.152: J6.17 28.45,22.69 27.21,23.93 26.99,23.93 26.67,24.25 v26.67,24.89 | v45.85,41.73 46.35,42.24 56.19,42.24 57.15,43.2 J24.8
  Top 0.762: J24.8 J23.8
  Bottom 0.152: v26.67,24.89 26.67,40.46 27.76,41.55 45.66,41.55 45.83,41.73 v45.85,41.73
TX2
  Top 0.152: J6.22 44.03,23.94 45.14,25.04 45.14,36.7 48.03,39.6 59.08,39.6 66.47,46.99 67.82,46.99 68.58,47.75 J25.4
  Top 0.762: J25.4 J26.4
USB_N  (via drill 0.3)
  Top 0.152: J6.5 17.89,19.69 v17.75,19.56
  Top 0.178: J1.B7 6.99,18.53 v7.11,18.41 7.11,17.78 6.86,17.53 J1.A7
  Bottom 0.178: v7.11,18.41 7.87,19.17 17.37,19.17 v17.75,19.56
USB_P  (via drill 0.3)
  Top 0.152: v17.73,18.82 18.1,19.19 J6.3
  Top 0.178: J1.A6 5.2,18.03 v4.95,17.78 4.95,17.27 5.2,17.03 J1.B6
  Bottom 0.178: v4.95,17.78 4.99,17.82 7.36,17.82 8.36,18.82 v17.73,18.82
USBHOST_N
  Top 0.152: J4.D- 13.63,37.97 16.13,37.97 16.76,37.34 | 16.76,37.34 J11.2 | J6.37 29.21,27.69 27.43,29.46 24.64,29.46 24.13,29.97 24.13,32.11 21.19,35.05 19.05,35.05 16.76,37.34
USBHOST_P
  Top 0.152: J6.35 29.33,27.19 27.31,29.21 24.53,29.21 23.88,29.87 23.88,32 21.08,34.8 J11.3 15.78,35.91 J4.D+
V_USB
  Top 0.406: J1.VBUS2 5.46,15.33 5.2,15.6 3.58,15.6 | J1.VBUS1 5.46,20.23 5.04,19.81 2.74,19.81
  Top 0.508: BYP.1 6.91,27.66 5.82,26.57 5.82,24.89 | 3.58,15.6 2.74,16.43 2.74,19.81 2.74,23.98 D4.A 4.17,24 5.05,24.89 5.82,24.89 | F2.1 5.82,24.89
VIN  (via drill 0.3)
  Top 0.178: R4.2 1.14,8.04 1.14,10.24 3.3,12.39 3.3,14.74 1.97,16.07 1.97,19.24 v2.03,19.3 | v3.56,20.6 3.56,22.33 4.29,23.06 6.73,23.06 7.11,23.44 7.11,24.54 7.44,24.87 F2.2
  Top 0.254: J6.9 v26.67,20.69 18.15,20.69 17.4,19.94 15.49,19.94 | v26.57,17.4 26.57,10.64 27.94,9.27 27.94,3.81 J8.4 | 15.49,19.94 15.53,19.9 R5.2 | 9.95,19.94 14.22,19.94 | 14.22,19.94 15.49,19.94 | R10.2 14.25,19.96 14.22,19.94
  Top 0.508: C1.1 C13.1 | F2.2 9.07,25.12 C2.+ 10.87,25.27 11.81,26.21 BYP.2
  Top 0.559: C2.+ 10.87,24.24 10.07,23.44 C1.1
  Top 0.762: 27.94,3.81 J9.1 J8.4
  Bottom 0.178: v2.03,19.3 3.05,19.3 3.56,19.81 v3.56,20.6
  Bottom 0.254: v26.57,17.4 26.54,17.42 26.54,20.56 v26.67,20.69
  pour Top (isolate 0.305, no thermals): 9.8,18.85 10.08,18.85 10.08,19.59 10.62,20.12 10.62,21.59 9.55,21.59 9.55,19.66 9.8,19.41
VIN/3  (via drill 0.3)
  Top 0.152: R10.1 15.72,22.72 R9.2 16.34,22.69 18.34,24.69 18.34,31.5 18.85,32 v22.86,32 | J6.49 25.19,30.69 25.02,30.86 25.02,31.98 v23.93,33.07
  Bottom 0.152: v22.86,32 v23.93,33.07

### Text on the board
Bottom: v11
tPlace: + | -
tDocu: Elias Santistevan